# EAGLE design EagleIO (EAGLE 7.2.0)

## Sheet 1 of 4
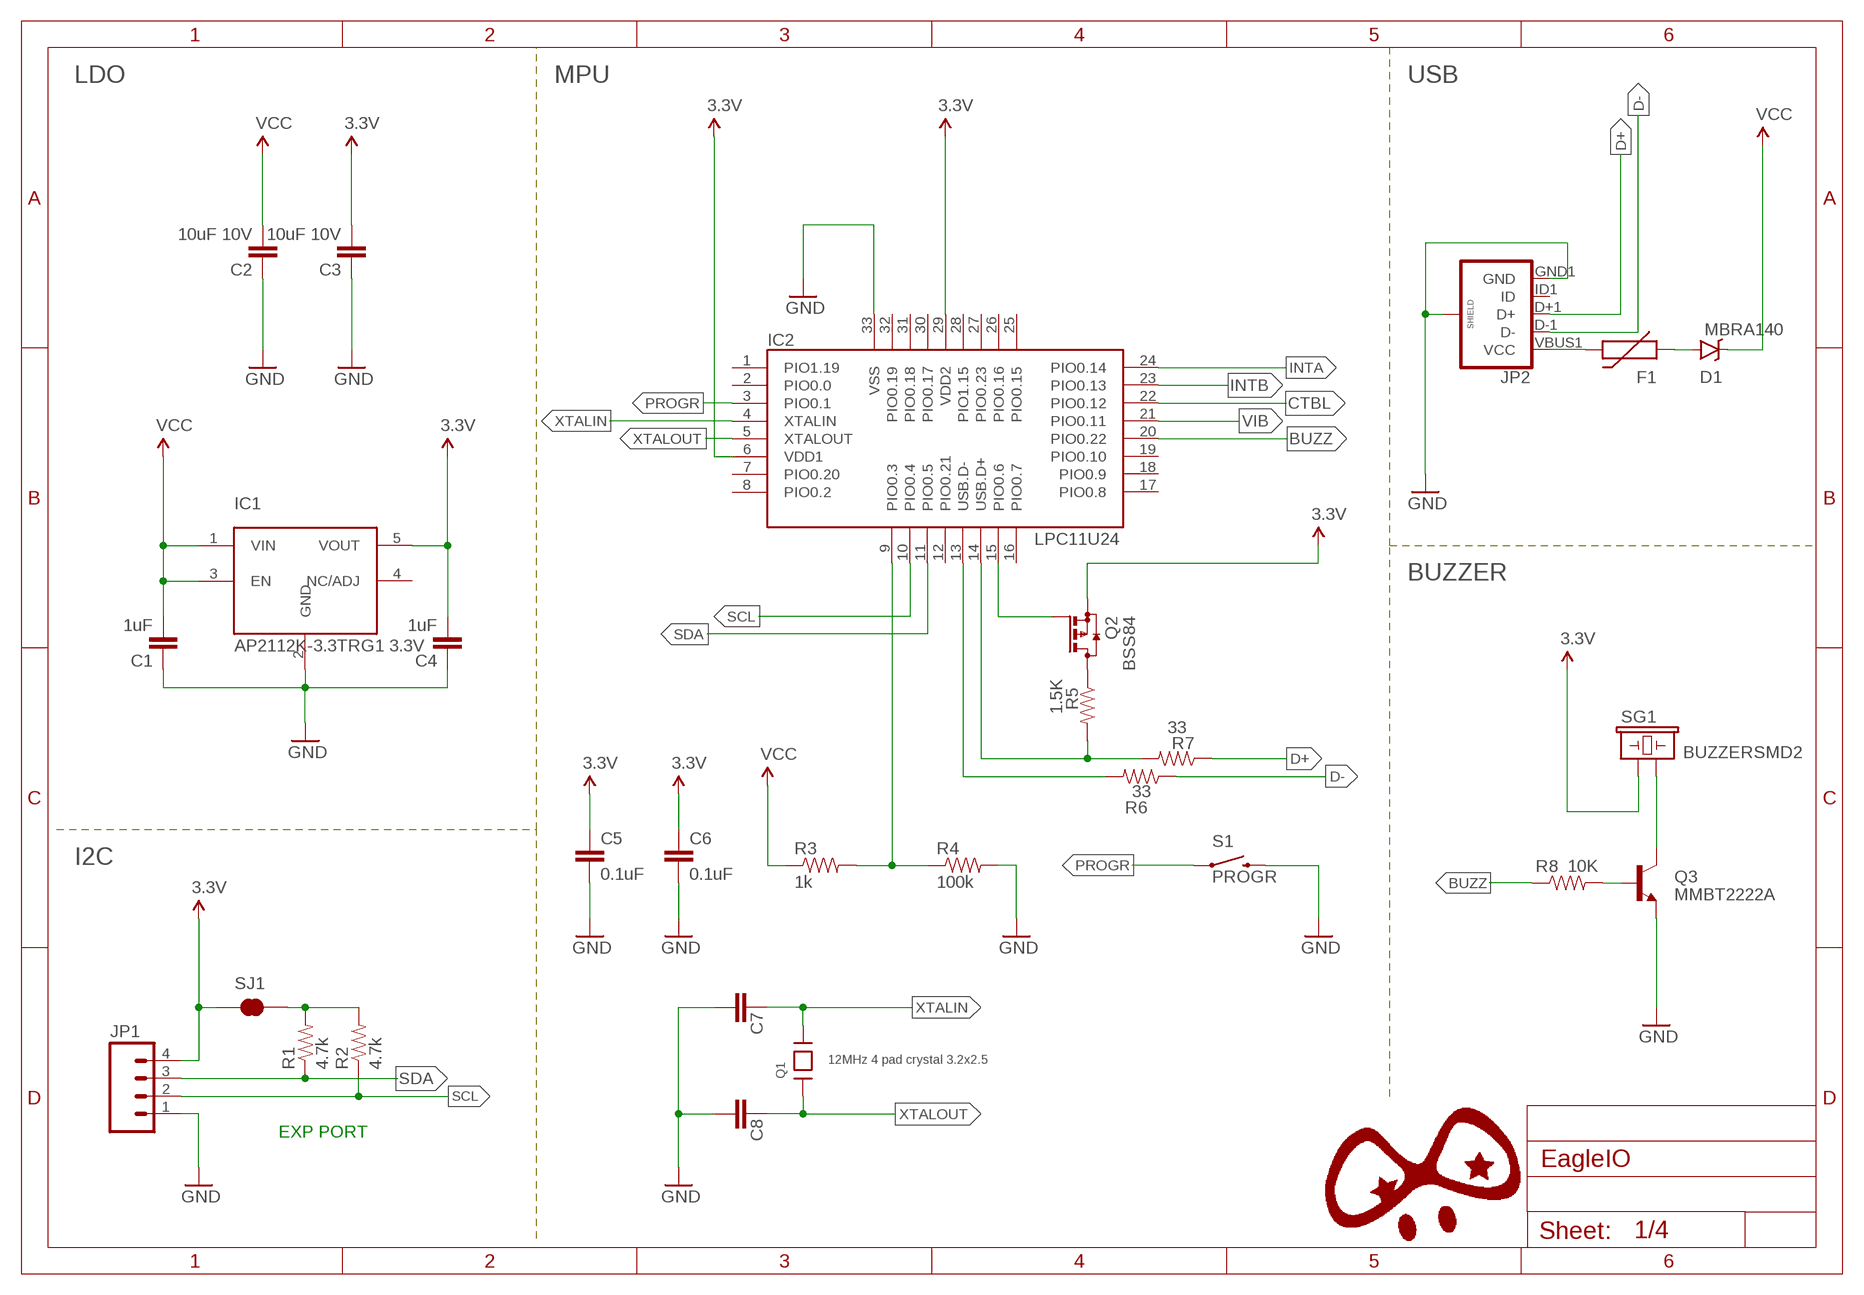
[diagram p0: schematic, sheet 1]

### Parts
C1  1uF  CAP0402-CAP  [0402-CAP]
C2  10uF 10V  CAP0402-CAP  [0402-CAP]
C3  10uF 10V  CAP0402-CAP  [0402-CAP]
C4  1uF  CAP0402-CAP  [0402-CAP]
C5  0.1uF  CAP0402-CAP  [0402-CAP]
C6  0.1uF  CAP0402-CAP  [0402-CAP]
C7  27pF  CAP0402-CAP  [0402-CAP]
C8  27pF  CAP0402-CAP  [0402-CAP]
D1  MBRA140  [SMA-DIODE]
F1  PTC0603  [0603]
IC1  AP2112K-3.3TRG1 3.3V  5PIN_REG  [SOT23-5]
IC2  LPC11U24  LPC11U2X_HVQFN33(5X5)  [HVQFN33_5X5MM]
JP1  M04LONGPADS  [1X04_LONGPADS]
JP2  USB_MICROB_PLUGCONN-11752  [USB-B-MICRO-SMD_V03]
Q1  12MHz 4 pad crystal 3.2x2.5  CRYSTAL3.2X2.5  [CRYSTAL_3.2X2.5]
Q2  BSS84  [SOT23]
Q3  MMBT2222A  TRANSISTOR_NPNMMBT2222A  [SOT23-3]
R1  4.7k  RESISTOR0402-RES  [0402-RES]
R2  4.7k  RESISTOR0402-RES  [0402-RES]
R3  1k  RESISTOR0402-RES  [0402-RES]
R4  100k  RESISTOR0402-RES  [0402-RES]
R5  1.5K  RESISTOR0402-RES  [0402-RES]
R6  33  RESISTOR0402-RES  [0402-RES]
R7  33  RESISTOR0402-RES  [0402-RES]
R8  10K  RESISTOR0402-RES  [0402-RES]
S1  PROGR  SWITCH-MOMENTARY-2SMD-1101NE  [TACTILE-SWITCH-1101NE]
SG1  BUZZERSMD2  [BUZZER-CCV]
SJ1  JUMPER-PAD-2-NC_BY_TRACE  [PAD-JUMPER-2-NC_BY_TRACE_YES_SILK]

### Nets
3.3V: C3.2 C4.2 C5.1 C6.1 IC1.5(VOUT) IC2.6(VDD1) IC2.29(VDD2) JP1.4 Q2.2(S) SG1.+ SJ1.1 ; also sheet 2,3,4
BUZZ: IC2.20(PIO0.22) R8.1
CTBL: IC2.22(PIO0.12) ; also sheet 4
D+: JP2.D+1(D+) R7.1
D-: JP2.D-1(D-) R6.1
GND: C1.1 C2.1 C3.1 C4.1 C5.2 C6.2 C7.2 C8.2 IC1.2(GND) IC2.33(VSS) JP1.1 JP2.GND1(GND) JP2.SHIELD1(SHIELD) JP2.SHIELD2(SHIELD) JP2.SHIELD3(SHIELD) Q3.2(E) R4.2 S1.2 ; also sheet 2,3,4
INTA: IC2.24(PIO0.14) ; also sheet 2
INTB: IC2.23(PIO0.13) ; also sheet 2
N$20: D1.A F1.1
N$21: F1.2 JP2.VBUS1(VCC)
N$28: Q3.3(C) SG1.-
N$30: Q3.1(B) R8.2
N$33: IC2.14(USB.D+) R5.2 R7.2
N$34: IC2.13(USB.D-) R6.2
N$35: Q2.3(D) R5.1
N$36: IC2.15(PIO0.6) Q2.1(G)
N$37 [power]: R1.2 R2.2 SJ1.2
P0.3/ISP_COMMAND_USB_HIGH: IC2.9(PIO0.3) R3.2 R4.1
PROGR: IC2.3(PIO0.1) S1.1
SCL: IC2.10(PIO0.4) JP1.2 R2.1 ; also sheet 2,4
SDA: IC2.11(PIO0.5) JP1.3 R1.1 ; also sheet 2,4
VCC: C1.2 C2.2 D1.C IC1.1(VIN) IC1.3(EN) R3.1 ; also sheet 4
VIB: IC2.21(PIO0.11) ; also sheet 3
XTALIN: C7.1 IC2.4(XTALIN) Q1.3
XTALOUT: C8.1 IC2.5(XTALOUT) Q1.1
Unconnected: IC1.4(NC/ADJ) IC2.1(PIO1.19) IC2.2(PIO0.0) IC2.7(PIO0.20) IC2.8(PIO0.2) IC2.12(PIO0.21) IC2.16(PIO0.7) IC2.17(PIO0.8) IC2.18(PIO0.9) IC2.19(PIO0.10) IC2.25(PIO0.15) IC2.26(PIO0.16) IC2.27(PIO0.23) IC2.28(PIO1.15) IC2.30(PIO0.17) IC2.31(PIO0.18) IC2.32(PIO0.19) JP2.ID1(ID)

### Notes on the sheet
- LDO | MPU | USB
- BUZZER
- I2C
- EXP PORT

## Sheet 2 of 4
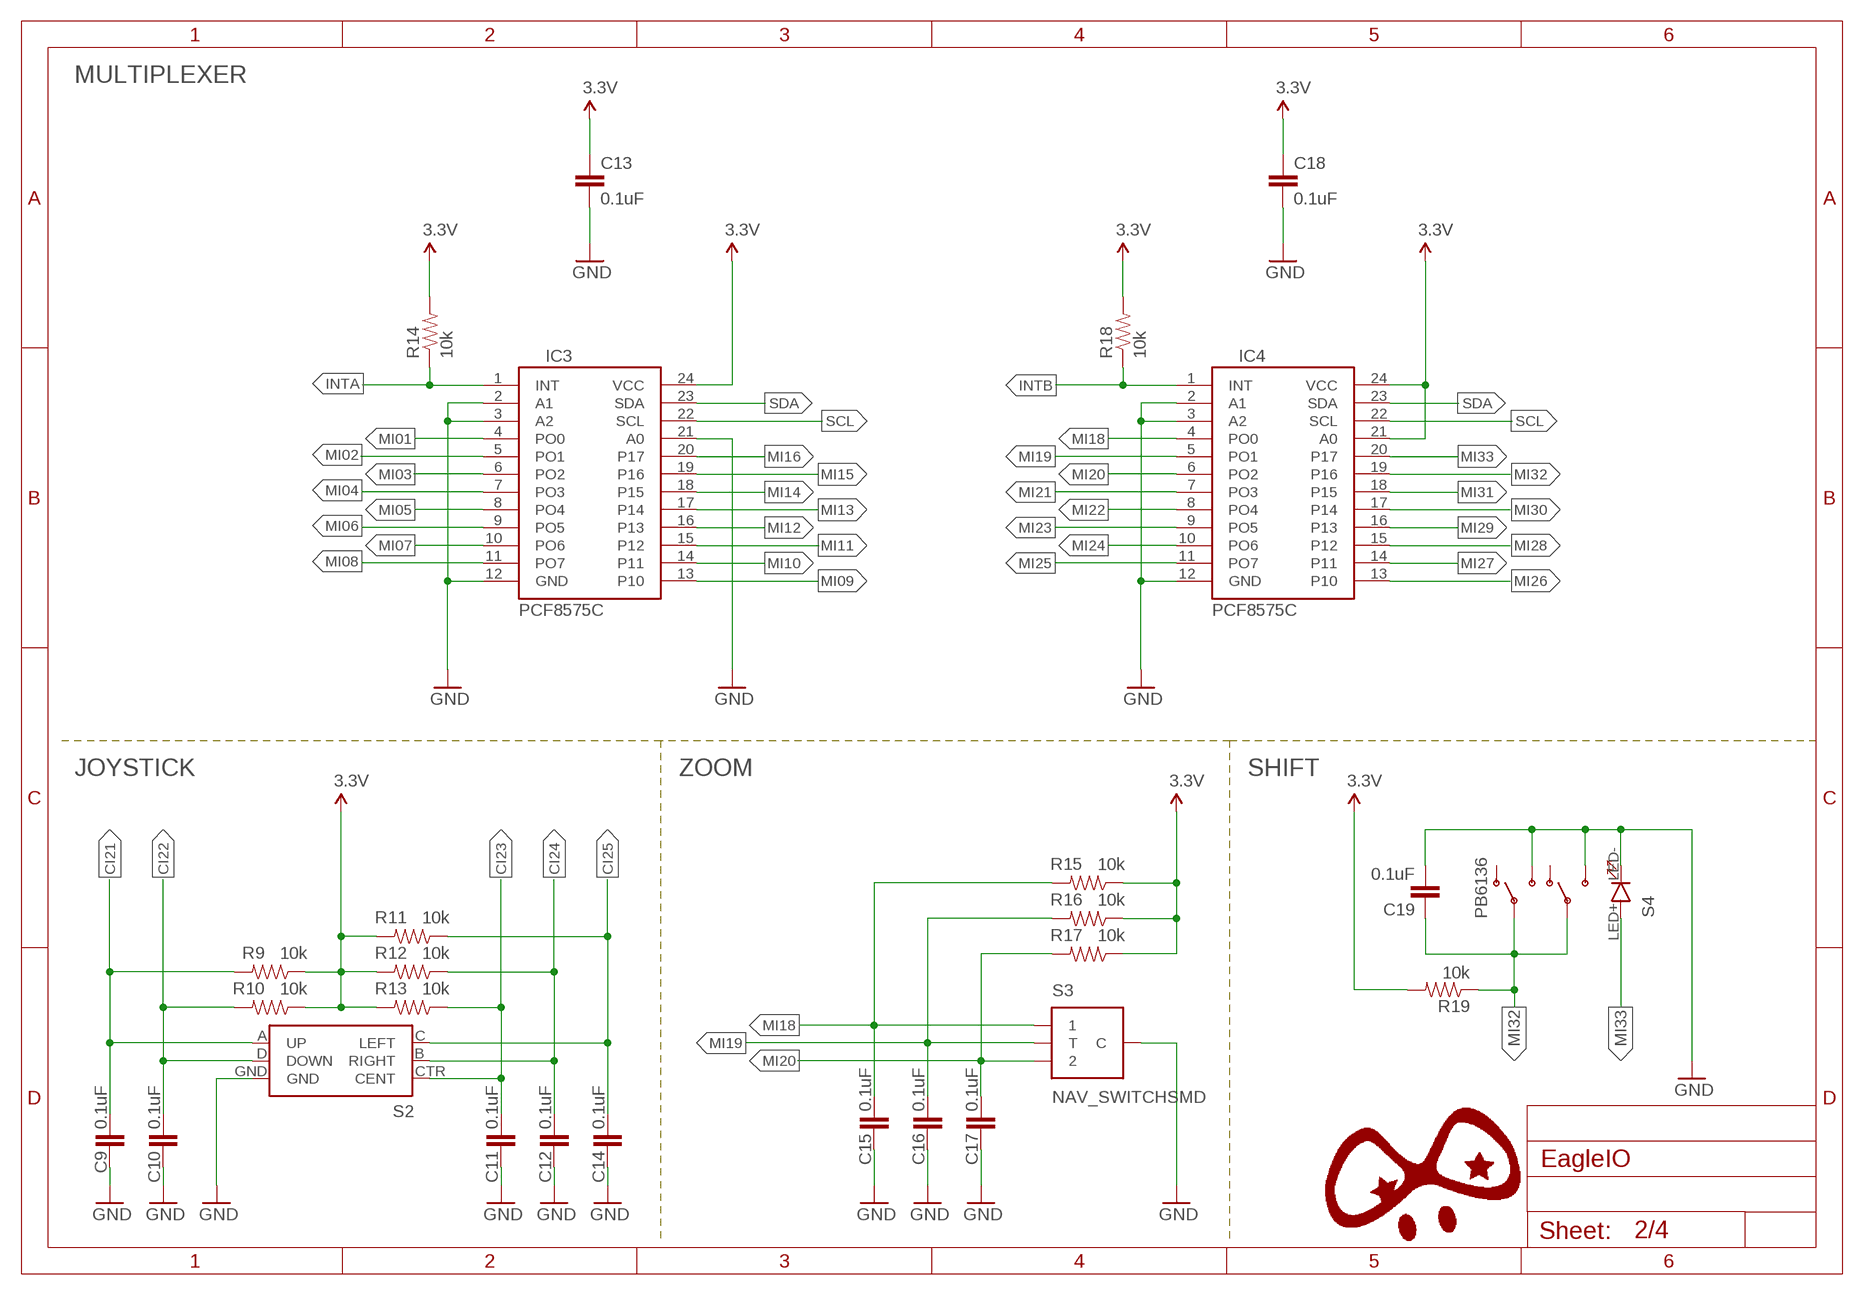
[diagram p1: schematic, sheet 2]

### Parts
C9  0.1uF  CAP0402-CAP  [0402-CAP]
C10  0.1uF  CAP0402-CAP  [0402-CAP]
C11  0.1uF  CAP0402-CAP  [0402-CAP]
C12  0.1uF  CAP0402-CAP  [0402-CAP]
C13  0.1uF  CAP0402-CAP  [0402-CAP]
C14  0.1uF  CAP0402-CAP  [0402-CAP]
C15  0.1uF  CAP0402-CAP  [0402-CAP]
C16  0.1uF  CAP0402-CAP  [0402-CAP]
C17  0.1uF  CAP0402-CAP  [0402-CAP]
C18  0.1uF  CAP0402-CAP  [0402-CAP]
C19  0.1uF  CAP0402-CAP  [0402-CAP]
IC3  PCF8575C  [SO-24DW]
IC4  PCF8575C  [SO-24DW]
R9  10k  RESISTOR0402-RES  [0402-RES]
R10  10k  RESISTOR0402-RES  [0402-RES]
R11  10k  RESISTOR0402-RES  [0402-RES]
R12  10k  RESISTOR0402-RES  [0402-RES]
R13  10k  RESISTOR0402-RES  [0402-RES]
R14  10k  RESISTOR0402-RES  [0402-RES]
R15  10k  RESISTOR0402-RES  [0402-RES]
R16  10k  RESISTOR0402-RES  [0402-RES]
R17  10k  RESISTOR0402-RES  [0402-RES]
R18  10k  RESISTOR0402-RES  [0402-RES]
R19  10k  RESISTOR0402-RES  [0402-RES]
S2  JOYSTICK_MINI  [JOYSTICK_MINI]
S3  NAV_SWITCHSMD  [NAV_SWITCH]
S4  PB6136  [PB6136]

### Nets
3.3V: C13.1 C18.1 IC3.24(VCC) IC4.21(A0) IC4.24(VCC) R9.1 R10.1 R11.2 R12.2 R13.2 R14.2 R15.1 R16.1 R17.1 R18.2 R19.2 ; also sheet 1,3,4
CI21: C9.2 R9.2 S2.A(UP) ; also sheet 4
CI22: C10.2 R10.2 S2.D(DOWN) ; also sheet 4
CI23: C11.2 R13.1 S2.CTR(CENT) ; also sheet 4
CI24: C12.2 R12.1 S2.B(RIGHT) ; also sheet 4
CI25: C14.2 R11.1 S2.C(LEFT) ; also sheet 4
GND: C9.1 C10.1 C11.1 C12.1 C13.2 C14.1 C15.1 C16.1 C17.1 C18.2 C19.2 IC3.2(A1) IC3.3(A2) IC3.12(GND) IC3.21(A0) IC4.2(A1) IC4.3(A2) IC4.12(GND) S2.GND S3.C S4.LED- S4.NO1(S) S4.NO2(S1) ; also sheet 1,3,4
INTA: IC3.1(INT) R14.1 ; also sheet 1
INTB: IC4.1(INT) R18.1 ; also sheet 1
MI01: IC3.4(PO0) ; also sheet 4
MI02: IC3.5(PO1) ; also sheet 4
MI03: IC3.6(PO2) ; also sheet 4
MI04: IC3.7(PO3) ; also sheet 4
MI05: IC3.8(PO4) ; also sheet 4
MI06: IC3.9(PO5) ; also sheet 4
MI07: IC3.10(PO6) ; also sheet 4
MI08: IC3.11(PO7) ; also sheet 4
MI09: IC3.13(P10) ; also sheet 4
MI10: IC3.14(P11) ; also sheet 4
MI11: IC3.15(P12) ; also sheet 4
MI12: IC3.16(P13) ; also sheet 4
MI13: IC3.17(P14) ; also sheet 3
MI14: IC3.18(P15) ; also sheet 3
MI15: IC3.19(P16)
MI16: IC3.20(P17)
MI18: C15.2 IC4.4(PO0) R15.2 S3.1
MI19: C16.2 IC4.5(PO1) R16.2 S3.T
MI20: C17.2 IC4.6(PO2) R17.2 S3.2
MI21: IC4.7(PO3) ; also sheet 4
MI22: IC4.8(PO4) ; also sheet 4
MI23: IC4.9(PO5) ; also sheet 4
MI24: IC4.10(PO6) ; also sheet 4
MI25: IC4.11(PO7) ; also sheet 4
MI26: IC4.13(P10) ; also sheet 4
MI27: IC4.14(P11) ; also sheet 4
MI28: IC4.15(P12) ; also sheet 4
MI29: IC4.16(P13)
MI30: IC4.17(P14)
MI31: IC4.18(P15)
MI32: C19.1 IC4.19(P16) R19.1 S4.C1(P) S4.C2(P1)
MI33: IC4.20(P17) S4.LED+
SCL: IC3.22(SCL) IC4.22(SCL) ; also sheet 1,4
SDA: IC3.23(SDA) IC4.23(SDA) ; also sheet 1,4
Unconnected: S4.NC1(O) S4.NC2(O1)

### Notes on the sheet
- MULTIPLEXER
- JOYSTICK | ZOOM | SHIFT

## Sheet 3 of 4
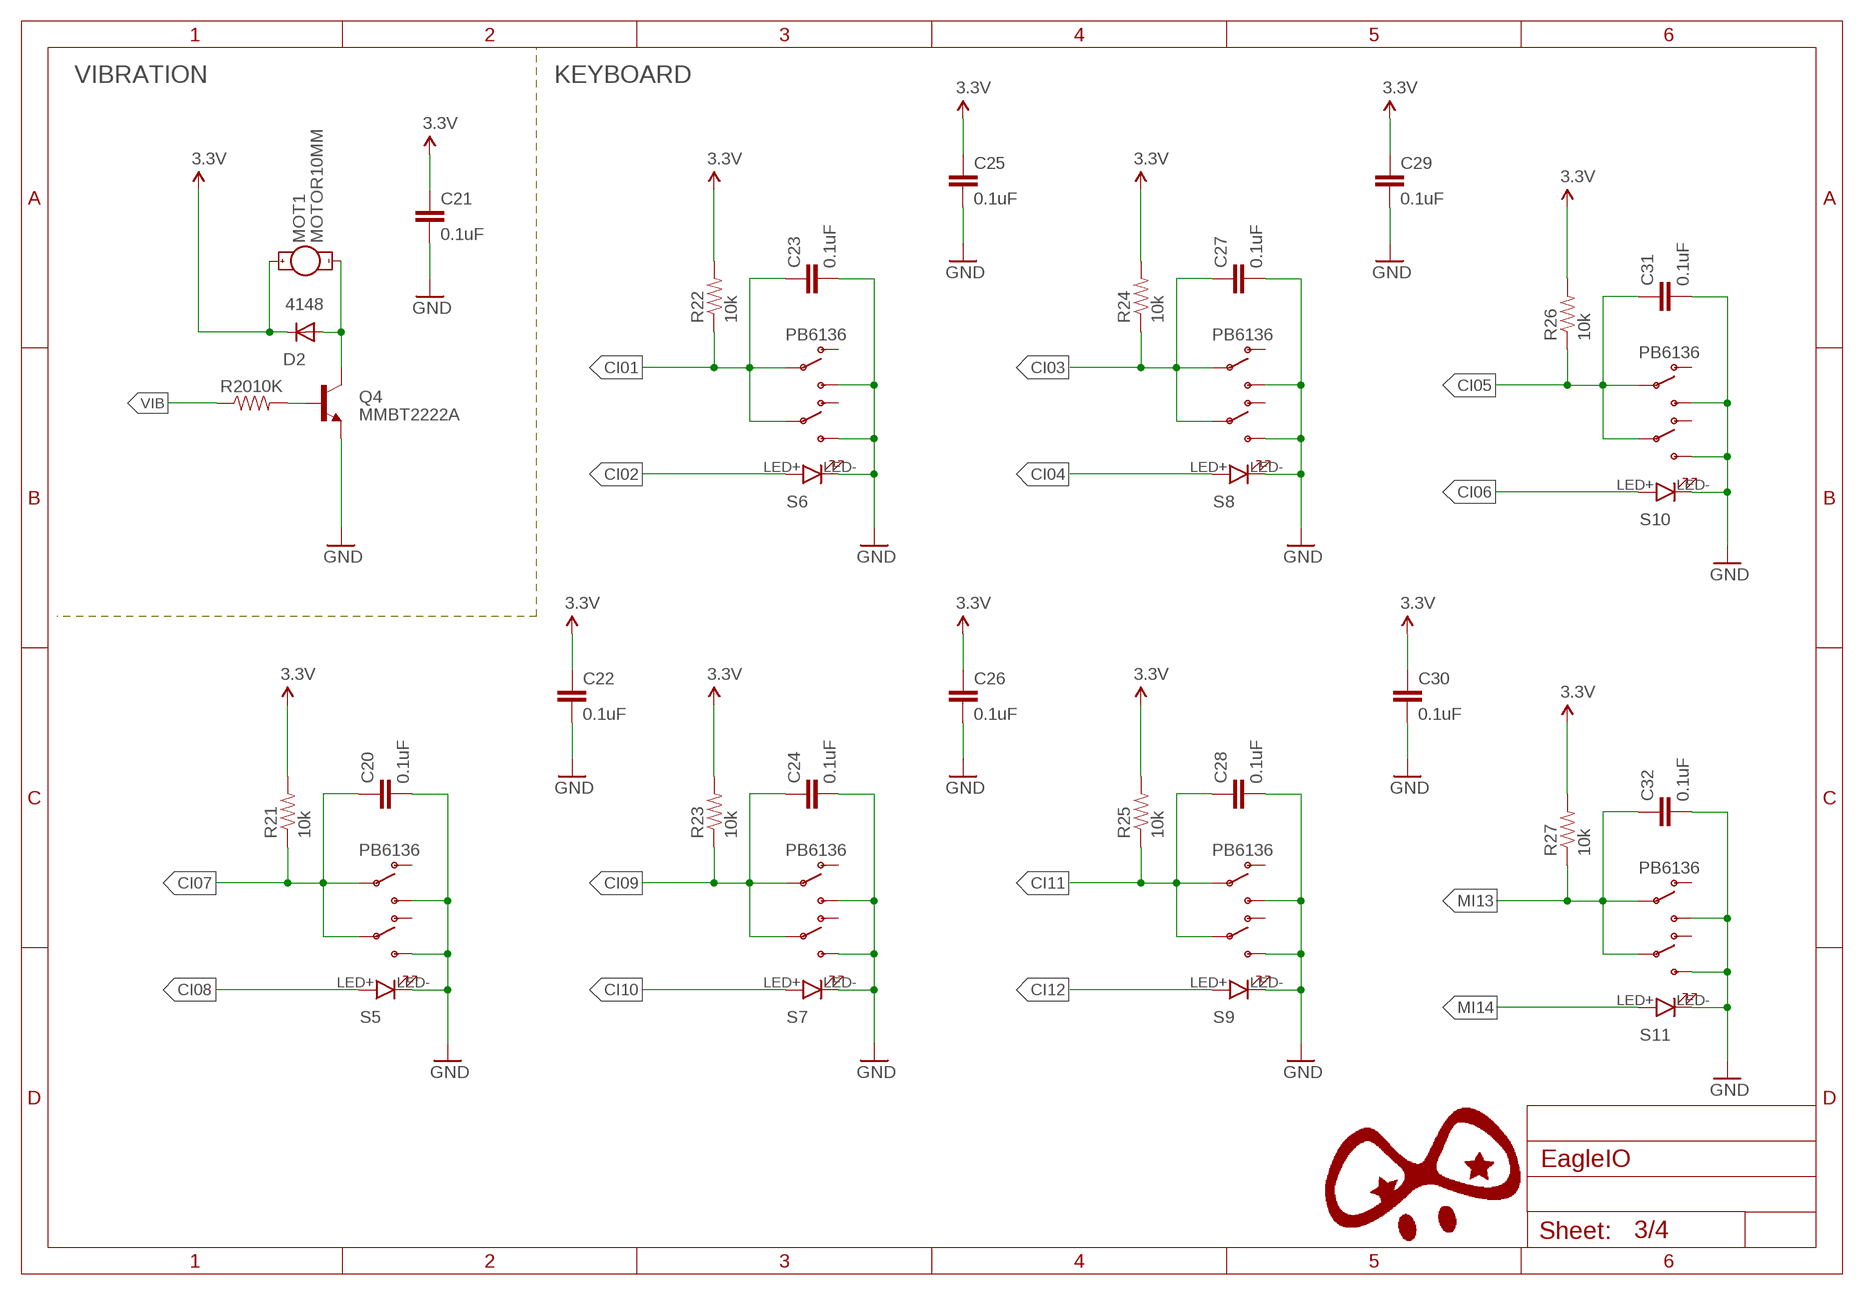
[diagram p2: schematic, sheet 3]

### Parts
C20  0.1uF  CAP0402-CAP  [0402-CAP]
C21  0.1uF  CAP0402-CAP  [0402-CAP]
C22  0.1uF  CAP0402-CAP  [0402-CAP]
C23  0.1uF  CAP0402-CAP  [0402-CAP]
C24  0.1uF  CAP0402-CAP  [0402-CAP]
C25  0.1uF  CAP0402-CAP  [0402-CAP]
C26  0.1uF  CAP0402-CAP  [0402-CAP]
C27  0.1uF  CAP0402-CAP  [0402-CAP]
C28  0.1uF  CAP0402-CAP  [0402-CAP]
C29  0.1uF  CAP0402-CAP  [0402-CAP]
C30  0.1uF  CAP0402-CAP  [0402-CAP]
C31  0.1uF  CAP0402-CAP  [0402-CAP]
C32  0.1uF  CAP0402-CAP  [0402-CAP]
D2  4148  DIODE-MINIMELF  [MINIMELF]
MOT1  MOTOR10MM  [VIBE-MOTOR-10MM]
Q4  MMBT2222A  TRANSISTOR_NPNMMBT2222A  [SOT23-3]
R20  10K  RESISTOR0402-RES  [0402-RES]
R21  10k  RESISTOR0402-RES  [0402-RES]
R22  10k  RESISTOR0402-RES  [0402-RES]
R23  10k  RESISTOR0402-RES  [0402-RES]
R24  10k  RESISTOR0402-RES  [0402-RES]
R25  10k  RESISTOR0402-RES  [0402-RES]
R26  10k  RESISTOR0402-RES  [0402-RES]
R27  10k  RESISTOR0402-RES  [0402-RES]
S5  PB6136  [PB6136]
S6  PB6136  [PB6136]
S7  PB6136  [PB6136]
S8  PB6136  [PB6136]
S9  PB6136  [PB6136]
S10  PB6136  [PB6136]
S11  PB6136  [PB6136]

### Nets
3.3V: C21.1 C22.1 C25.1 C26.1 C29.1 C30.1 D2.C MOT1.+ R21.2 R22.2 R23.2 R24.2 R25.2 R26.2 R27.2 ; also sheet 1,2,4
CI01: C23.1 R22.1 S6.C1(P) S6.C2(P1) ; also sheet 4
CI02: S6.LED+ ; also sheet 4
CI03: C27.1 R24.1 S8.C1(P) S8.C2(P1) ; also sheet 4
CI04: S8.LED+ ; also sheet 4
CI05: C31.1 R26.1 S10.C1(P) S10.C2(P1) ; also sheet 4
CI06: S10.LED+ ; also sheet 4
CI07: C20.1 R21.1 S5.C1(P) S5.C2(P1) ; also sheet 4
CI08: S5.LED+ ; also sheet 4
CI09: C24.1 R23.1 S7.C1(P) S7.C2(P1) ; also sheet 4
CI10: S7.LED+ ; also sheet 4
CI11: C28.1 R25.1 S9.C1(P) S9.C2(P1) ; also sheet 4
CI12: S9.LED+ ; also sheet 4
GND: C20.2 C21.2 C22.2 C23.2 C24.2 C25.2 C26.2 C27.2 C28.2 C29.2 C30.2 C31.2 C32.2 Q4.2(E) S5.LED- S5.NO1(S) S5.NO2(S1) S6.LED- S6.NO1(S) S6.NO2(S1) S7.LED- S7.NO1(S) S7.NO2(S1) S8.LED- S8.NO1(S) S8.NO2(S1) S9.LED- S9.NO1(S) S9.NO2(S1) S10.LED- S10.NO1(S) S10.NO2(S1) S11.LED- S11.NO1(S) S11.NO2(S1) ; also sheet 1,2,4
MI13: C32.1 R27.1 S11.C1(P) S11.C2(P1) ; also sheet 2
MI14: S11.LED+ ; also sheet 2
N$1: D2.A MOT1.- Q4.3(C)
N$2: Q4.1(B) R20.2
VIB: R20.1 ; also sheet 1
Unconnected: S5.NC1(O) S5.NC2(O1) S6.NC1(O) S6.NC2(O1) S7.NC1(O) S7.NC2(O1) S8.NC1(O) S8.NC2(O1) S9.NC1(O) S9.NC2(O1) S10.NC1(O) S10.NC2(O1) S11.NC1(O) S11.NC2(O1)

### Notes on the sheet
- VIBRATION | KEYBOARD

## Sheet 4 of 4
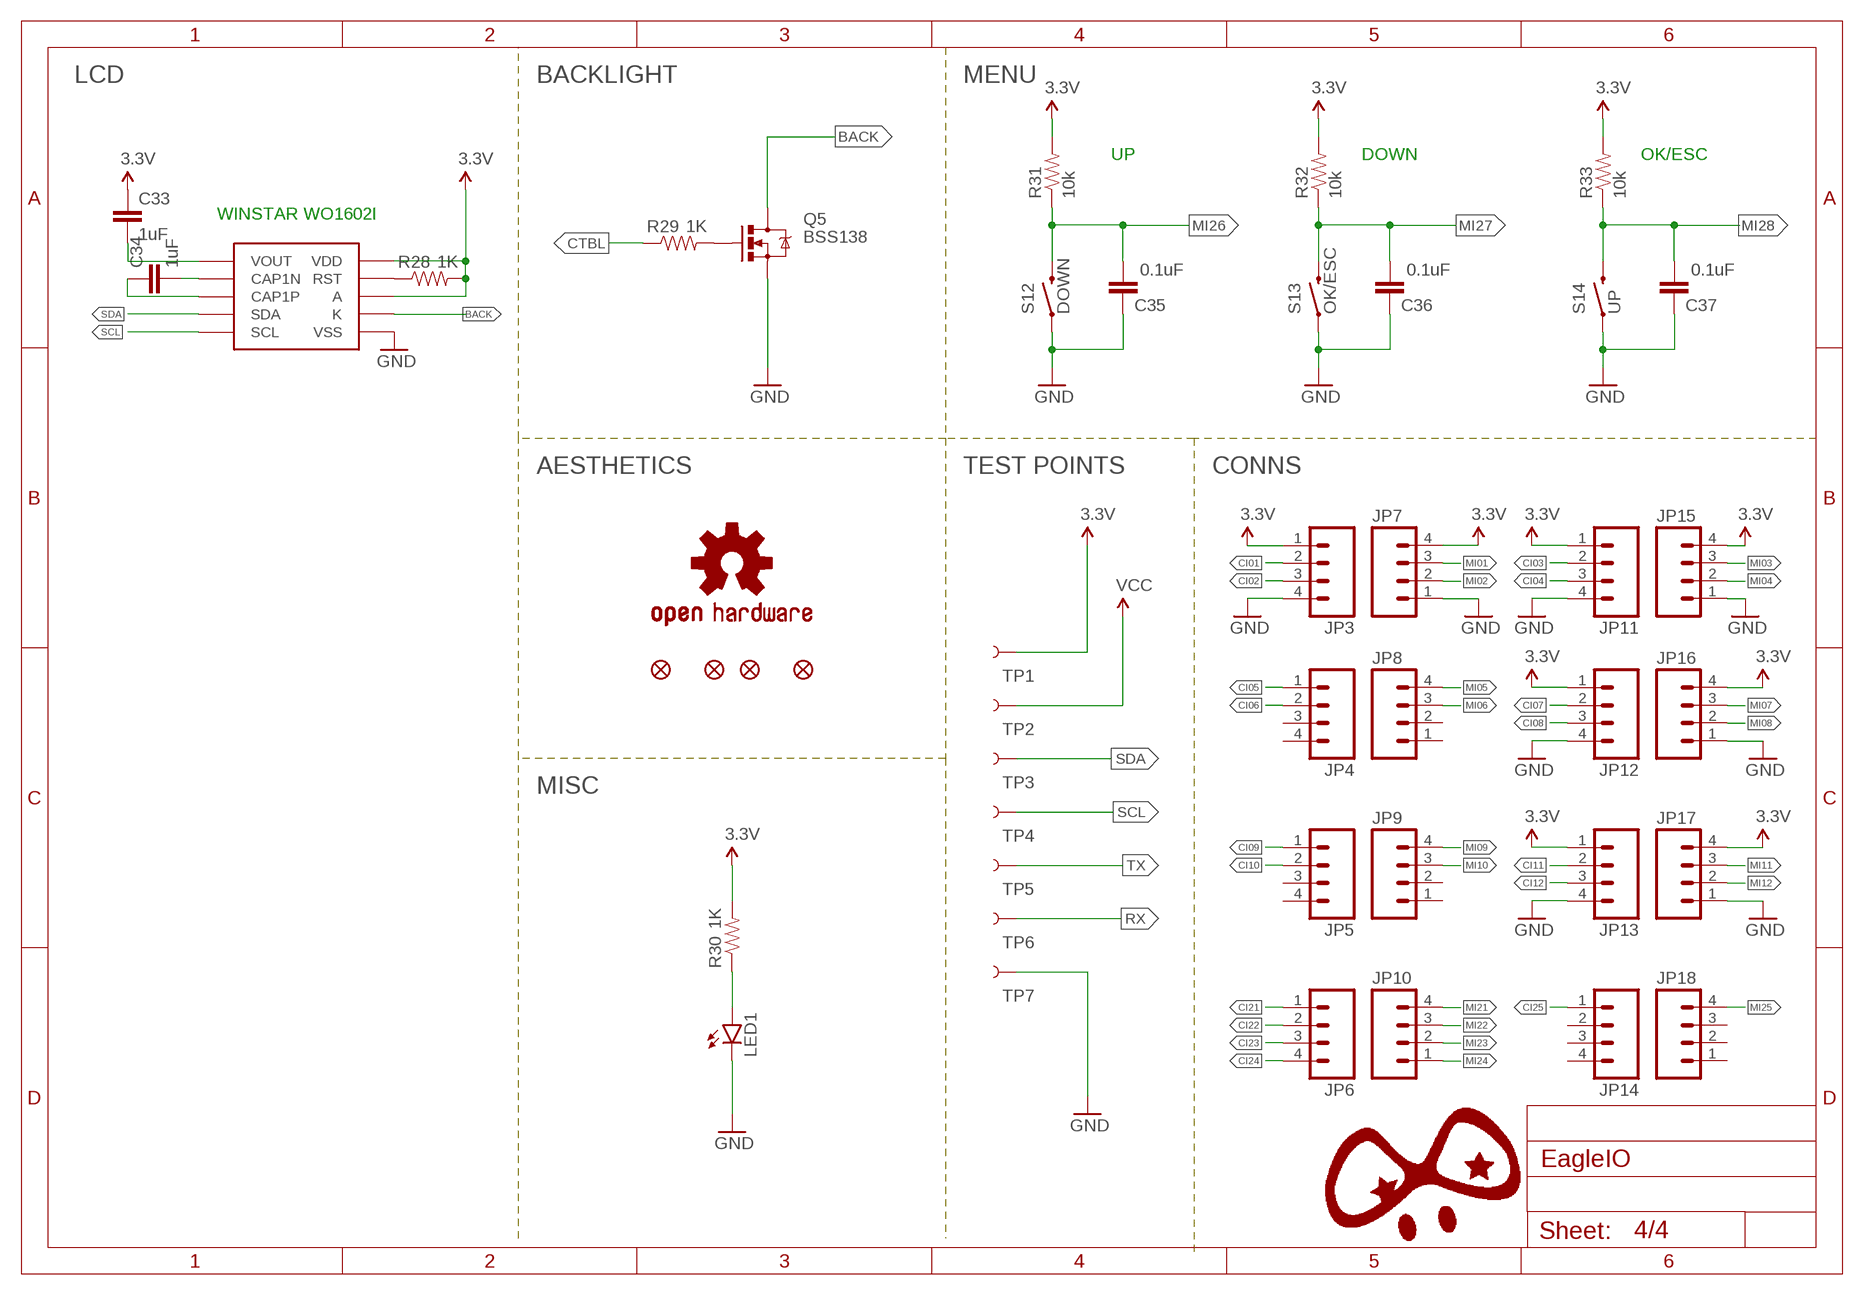
[diagram p3: schematic, sheet 4]

### Parts
C33  1uF  CAP0402-CAP  [0402-CAP]
C34  1uF  CAP0402-CAP  [0402-CAP]
C35  0.1uF  CAP0402-CAP  [0402-CAP]
C36  0.1uF  CAP0402-CAP  [0402-CAP]
C37  0.1uF  CAP0402-CAP  [0402-CAP]
FID1  FIDUCIAL1X2  [FIDUCIAL-1X2]
FID2  FIDUCIAL1X2  [FIDUCIAL-1X2]
FID3  FIDUCIAL1X2  [FIDUCIAL-1X2]
FID4  FIDUCIAL1X2  [FIDUCIAL-1X2]
JP3  M041.27MM  [1X04-1.27MM]
JP4  M041.27MM  [1X04-1.27MM]
JP5  M041.27MM  [1X04-1.27MM]
JP6  M041.27MM  [1X04-1.27MM]
JP7  M041.27MM  [1X04-1.27MM]
JP8  M041.27MM  [1X04-1.27MM]
JP9  M041.27MM  [1X04-1.27MM]
JP10  M041.27MM  [1X04-1.27MM]
JP11  M041.27MM  [1X04-1.27MM]
JP12  M041.27MM  [1X04-1.27MM]
JP13  M041.27MM  [1X04-1.27MM]
JP14  M041.27MM  [1X04-1.27MM]
JP15  M041.27MM  [1X04-1.27MM]
JP16  M041.27MM  [1X04-1.27MM]
JP17  M041.27MM  [1X04-1.27MM]
JP18  M041.27MM  [1X04-1.27MM]
LCD1  WINSTAR_WO1602I  [WINSTAR_WO1602I]
LED1  LED0603  [LED-0603]
LOGO1  OSHW-LOGOS  [OSHW-LOGO-S]
Q5  BSS138  MOSFET-NCHANNEL2N7002PW  [SOT323]
R28  1K  RESISTOR0402-RES  [0402-RES]
R29  1K  RESISTOR0402-RES  [0402-RES]
R30  1K  RESISTOR0402-RES  [0402-RES]
R31  10k  RESISTOR0402-RES  [0402-RES]
R32  10k  RESISTOR0402-RES  [0402-RES]
R33  10k  RESISTOR0402-RES  [0402-RES]
S12  DOWN  SWITCH-MOMENTARY-2SMD-1101NE  [TACTILE-SWITCH-1101NE]
S13  OK/ESC  SWITCH-MOMENTARY-2SMD-1101NE  [TACTILE-SWITCH-1101NE]
S14  UP  SWITCH-MOMENTARY-2SMD-1101NE  [TACTILE-SWITCH-1101NE]
TP1  TEST-POINT3X5  [PAD.03X.05]
TP2  TEST-POINT3X5  [PAD.03X.05]
TP3  TEST-POINT3X5  [PAD.03X.05]
TP4  TEST-POINT3X5  [PAD.03X.05]
TP5  TEST-POINT3X5  [PAD.03X.05]
TP6  TEST-POINT3X5  [PAD.03X.05]
TP7  TEST-POINT3X5  [PAD.03X.05]

### Nets
3.3V: C33.1 JP3.1 JP7.4 JP11.1 JP12.1 JP13.1 JP15.4 JP16.4 JP17.4 LCD1.AB(A) LCD1.AT(A) LCD1.VDD R28.2 R30.2 R31.2 R32.2 R33.2 TP1.P$1 ; also sheet 1,2,3
BACK: LCD1.KB(K) LCD1.KT(K) Q5.3(D)
CI01: JP3.2 ; also sheet 3
CI02: JP3.3 ; also sheet 3
CI03: JP11.2 ; also sheet 3
CI04: JP11.3 ; also sheet 3
CI05: JP4.1 ; also sheet 3
CI06: JP4.2 ; also sheet 3
CI07: JP12.2 ; also sheet 3
CI08: JP12.3 ; also sheet 3
CI09: JP5.1 ; also sheet 3
CI10: JP5.2 ; also sheet 3
CI11: JP13.2 ; also sheet 3
CI12: JP13.3 ; also sheet 3
CI21: JP6.1 ; also sheet 2
CI22: JP6.2 ; also sheet 2
CI23: JP6.3 ; also sheet 2
CI24: JP6.4 ; also sheet 2
CI25: JP14.1 ; also sheet 2
CTBL: R29.1 ; also sheet 1
GND: C35.1 C36.1 C37.1 JP3.4 JP7.1 JP11.4 JP12.4 JP13.4 JP15.1 JP16.1 JP17.1 LCD1.VSS LED1.C Q5.2(S) S12.1 S13.1 S14.1 TP7.P$1 ; also sheet 1,2,3
MI01: JP7.3 ; also sheet 2
MI02: JP7.2 ; also sheet 2
MI03: JP15.3 ; also sheet 2
MI04: JP15.2 ; also sheet 2
MI05: JP8.4 ; also sheet 2
MI06: JP8.3 ; also sheet 2
MI07: JP16.3 ; also sheet 2
MI08: JP16.2 ; also sheet 2
MI09: JP9.4 ; also sheet 2
MI10: JP9.3 ; also sheet 2
MI11: JP17.3 ; also sheet 2
MI12: JP17.2 ; also sheet 2
MI21: JP10.4 ; also sheet 2
MI22: JP10.3 ; also sheet 2
MI23: JP10.2 ; also sheet 2
MI24: JP10.1 ; also sheet 2
MI25: JP18.4 ; also sheet 2
MI26: C35.2 R31.1 S12.2 ; also sheet 2
MI27: C36.2 R32.1 S13.2 ; also sheet 2
MI28: C37.2 R33.1 S14.2 ; also sheet 2
N$6: Q5.1(G) R29.2
N$8: LED1.A R30.1
N$10: C33.2 LCD1.VOUT
N$11: LCD1.RST R28.1
N$12: C34.2 LCD1.CAPN(CAP1N)
N$13: C34.1 LCD1.CAP1P
RX: TP6.P$1
SCL: LCD1.SCL TP4.P$1 ; also sheet 1,2
SDA: LCD1.SDA TP3.P$1 ; also sheet 1,2
TX: TP5.P$1
VCC: TP2.P$1 ; also sheet 1
Unconnected: JP4.3 JP4.4 JP5.3 JP5.4 JP8.1 JP8.2 JP9.1 JP9.2 JP14.2 JP14.3 JP14.4 JP18.1 JP18.2 JP18.3

### Notes on the sheet
- LCD | BACKLIGHT | MENU
- UP | DOWN | OK/ESC
- WINSTAR WO1602I
- AESTHETICS | TEST POINTS | CONNS
- MISC

## Library data of the parts
C1-C37 = SparkFun-Passives:CAP: Capacitor Standard 0603 ceramic capacitor, and 0.1" leaded capacitor.
D1 = SparkFun-DiscreteSemi:MBRA140: 40V, 1A Schottky rectifier SMA/DO-214AC package DIO-08053; PROD_ID: DIO-08053
D2 = diode:DIODE-: DIODE
F1 = SparkFun-PowerIC:PTC: Resettable Fuse PTC Resettable Fuse. Spark Fun Electronics SKU : COM-08357
FID1-FID4 = SparkFun-Aesthetics:FIDUCIAL: Fiducial Alignment Points Various fiducial points for machine vision alignment.
IC1 = GHI:5PIN_REG
IC2 = GHI-SoMs-Processors:LPC11U2X_HVQFN33(5X5)
IC3 IC4 = SparkFun-DigitalIC:PCF8575C: PCF8575C I/O Expander.
JP1 JP3-JP18 = SparkFun-Connectors:M04: Header 4 Standard 4-pin 0.1" header. Use with straight break away headers (SKU : PRT-00116), right angle break away headers (PRT-00553), swiss pins (PRT-00743), machine pins (PRT-00117), and female headers (PRT-00115). Molex polarized connector foot print use with SKU : PRT-08231 with associated crimp pins and housings. 1MM SMD Version SKU: PRT-10208
JP2 = SparkFun-Connectors:USB_MICROB_PLUG: USB Micro-B connectors Some male, some female. Watch your step!; PROD_ID: CONN-11752
LCD1 = pighiXXX:WINSTAR_WO1602I
LED1 = SparkFun-LED:LED: LEDs Standard schematic elements and footprints for 5mm, 3mm, 1206, and 0603 sized LEDs. 5mm - Spark Fun Electronics SKU : COM-00529 (and others)
LOGO1 = SparkFun-Aesthetics:OSHW-LOGO: Open Source Hardware Logo This logo indicates the piece of hardware it is found on incorporates a OSHW license and/or adheres to the definition of open source hardware found here: http://freedomdefined.org/OSHW
MOT1 = SparkFun-Electromechanical:MOTOR: Vibration Motor- ROB-08449 Physical dimension and wire connections for this powerful vibration motor. Motor has a self adhesive backing.
Q1 = GHI:CRYSTAL3.2X2.5
Q2 = transistor-small-signal:BSS84: P-CHANNEL MOS FET
Q3 Q4 = SparkFun-DiscreteSemi:TRANSISTOR_NPN: Generic NPN BJT MMBT2222A - TRANS-08049 (SOT-23, 1A 40V) MPSA42 - TRANS-09116 (SOT-23, 500mA 300V) MMBT5088LT1G - TRANS-11160 (SOT-23, 50 mA 30V) BC547 - COM-08928 (TO-92 45V 100mA) (1.Collector 2.Base 3.Emitter) 2N3904 - COM-00521 (TO-92 40V 200mA) (1.Emitter 2.Base 3.Collector) P2N2222A - COM-12852 (TO-92 40V 600mA) (1.Collector 2.Base 3.Emitter); PROD_ID: TRANS-08049
Q5 = SparkFun-DiscreteSemi:MOSFET-NCHANNEL: Common NMOSFET Parts MFG P/N Store ID Prod ID FDD8780 TRANS-09984 SI7820DN TRANS-11055 FDS6630A IC-08089 2N7002PW TRANS-11151 FQP30N06L COM-10213 TRANS-10060 BSS123LT1G TRANS-08345 BSS138 TRANS-00830 BS170 2N7000; PROD_ID: TRANS-11151
R1-R7 R9-R19 R21-R27 R31-R33 = SparkFun-Passives:RESISTOR: Resistor Basic schematic elements and footprints for 0603, 1206, and PTH resistors.
R8 R20 R28-R30 = SparkFun:RESISTOR: Resistor Basic schematic elements and footprints for 0603, 1206, and PTH resistors.
S1 S12-S14 = SparkFun-Electromechanical:SWITCH-MOMENTARY-2: Various NO switches- pushbuttons, reed, etc; PROD_ID: SWCH-00815
S2 = SparkFun-Electromechanical:JOYSTICK_MINI: Small 5-way tactile joystick, COM-10063 4UCON SF303GJ26; PROD_ID: SWCH-09905
S3 = SparkFun-Electromechanical:NAV_SWITCH: Navigation Switch Three way navigation switch. Commonly used as up/down/select on MP3 players. Schematic element and footprint production proven. Spark Fun Electronics SKU : COM-08184
S4-S11 = SparkFun-Electromechanical:PB6136
SG1 = SparkFun-Electromechanical:BUZZER: Buzzer 12mm Spark Fun Electronics SKU : Comp-Buzzer
SJ1 = SparkFun-Passives:JUMPER-PAD-2-NC_BY_TRACE
TP1-TP7 = SparkFun-Passives:TEST-POINT: Bare copper test points for troubleshooting or ICT

## Net classes
0 default: width 0.254 mm, drill 0.254 mm, clearance 0.203 mm
1 power: width 0.61 mm, drill 0.61 mm, clearance 0.254 mm

## Board
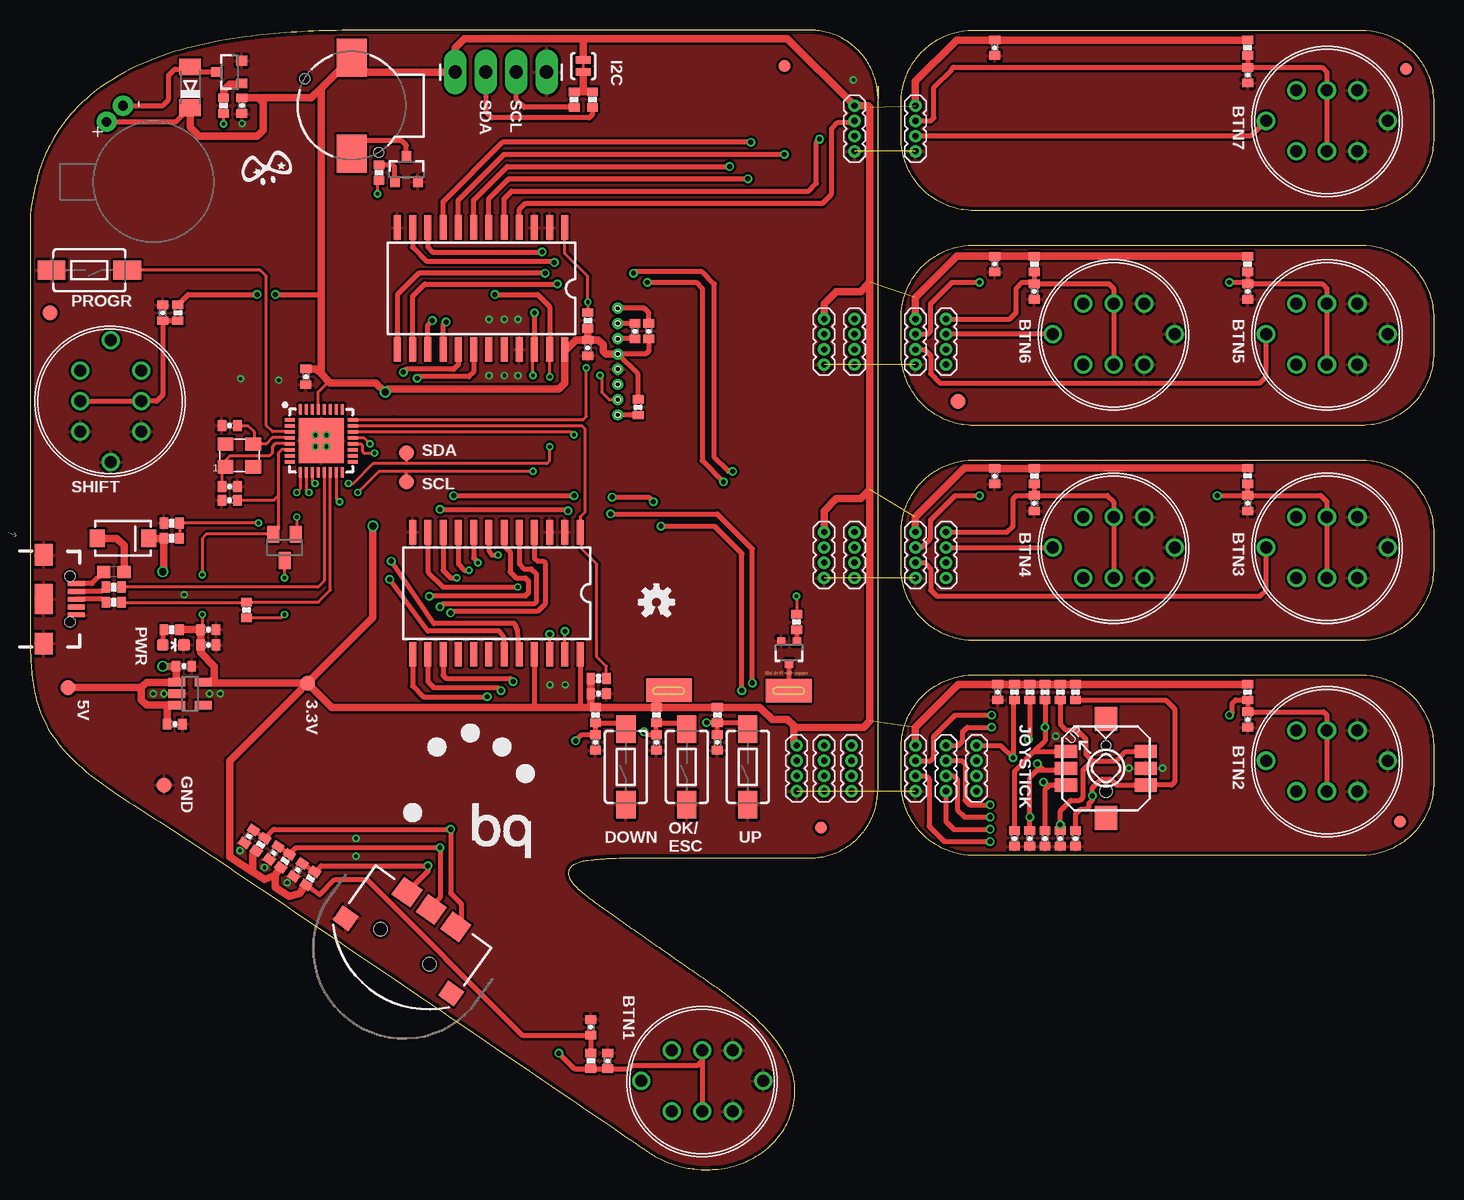
[diagram p4: board, top side]
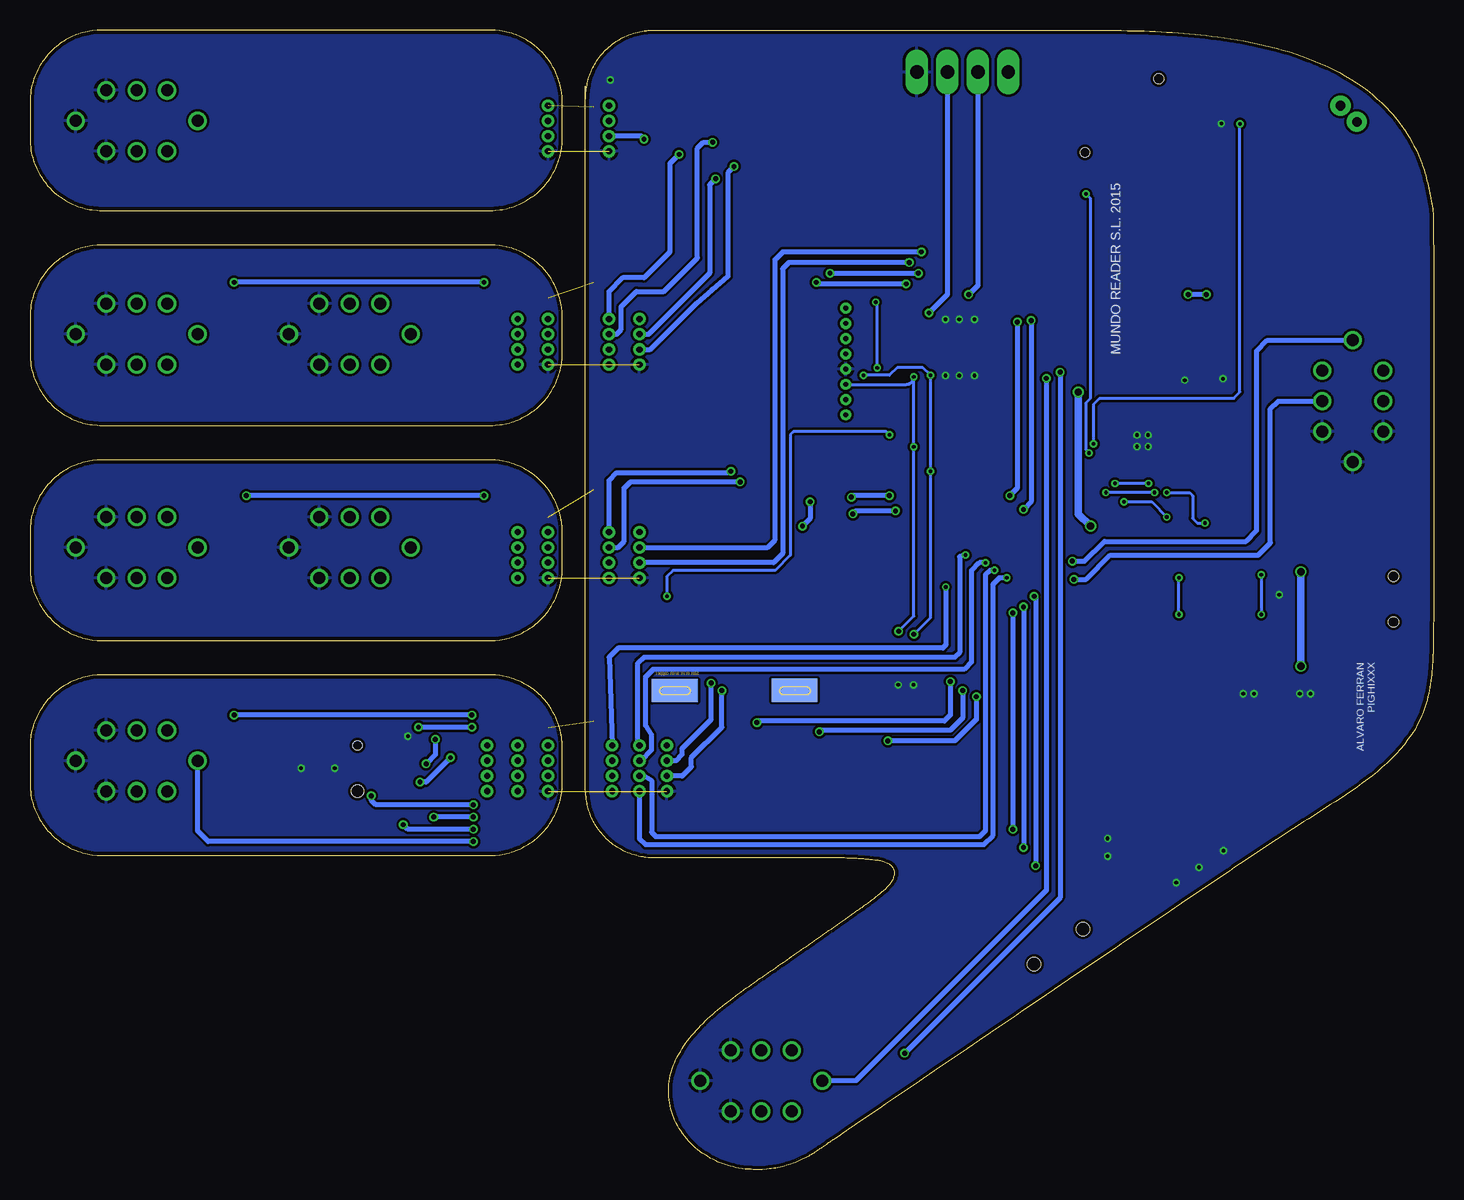
[diagram p5: board, bottom side, seen from below]

Size 116.96 x 95.01 mm. Coordinates in mm from the lower left corner, seen from the top.
Outline: 1309 segments
Copper layers (1*16): Top 0.035mm / dielectric 1.5mm / Bottom 0.035mm
Design rules "pighixxx_CAM_DRC_V1.0": minimum track width 6mil, minimum drill 12mil, track to track 6mil, track to pad 6mil, pad to pad 6mil, via to via 6mil, smd to smd 0mil, copper to edge 10mil, drill to drill 10mil, minimum pad ring 10mil, minimum via ring 6mil, stop-mask expansion 2mil, vias tented up to drill 100mil, thermal gap 10mil

### Footprints (pad centres in the part's own frame; a part is rotated, then mirrored left to right if it is on the bottom)
0402-CAP = smd 0.7 x 0.9: 1 -0.65,0; 2 0.65,0
SMA-DIODE = smd 1.27 x 1.47: A -2.15,0; C 2.15,0
MINIMELF = smd 1.4 x 1.8: A 1.7,0; C -1.7,0
0603 = smd 1.1 x 1: 1 -0.85,0; 2 0.85,0
FIDUCIAL-1X2 = smd 1 x 1: 1 0,0
SOT23-5 = smd 0.7 x 1.4: 1 0.95,1.1; 2 0,1.1; 3 -0.95,1.1; 4 -0.95,-1.1; 5 0.95,-1.1
HVQFN33_5X5MM = smd 0.85 x 0.27: 1 -2.625,1.75; 2 -2.625,1.25; 3 -2.625,0.75; 4 -2.625,0.25; 5 -2.625,-0.25; 6 -2.625,-0.75; 7 -2.625,-1.25; 8 -2.625,-1.75; 17 2.625,-1.75; 18 2.625,-1.25; 19 2.625,-0.75; 20 2.625,-0.25; 21 2.625,0.25; 22 2.625,0.75; 23 2.625,1.25; 24 2.625,1.75 | smd 0.27 x 0.85: 9 -1.75,-2.625; 10 -1.25,-2.625; 11 -0.75,-2.625; 12 -0.25,-2.625; 13 0.25,-2.625; 14 0.75,-2.625; 15 1.25,-2.625; 16 1.75,-2.625; 25 1.75,2.625; 26 1.25,2.625; 27 0.75,2.625; 28 0.25,2.625; 29 -0.25,2.625; 30 -0.75,2.625; 31 -1.25,2.625; 32 -1.75,2.625 | smd 3.75 x 3.75: 33 0,0
SO-24DW = smd 0.584 x 2.032: 1 -6.35,-5.08; 2 -5.08,-5.08; 3 -3.81,-5.08; 4 -2.54,-5.08; 5 -1.27,-5.08; 6 0,-5.08; 7 1.27,-5.08; 8 2.54,-5.08; 9 3.81,-5.08; 10 5.08,-5.08; 11 6.35,-5.08; 12 7.62,-5.08; 13 7.62,5.08; 14 6.35,5.08; 15 5.08,5.08; 16 3.81,5.08; 17 2.54,5.08; 18 1.27,5.08; 19 0,5.08; 20 -1.27,5.08; 21 -2.54,5.08; 22 -3.81,5.08; 23 -5.08,5.08; 24 -6.35,5.08
1X04_LONGPADS = drill 1.118 pad 1.88 long: 1 0,0; 2 2.54,0; 3 5.08,0; 4 7.62,0
USB-B-MICRO-SMD_V03 = smd 1.4 x 0.4: D+1 2.7,0; D-1 2.7,0.65; GND1 2.7,-1.3; ID1 2.7,-0.65; VBUS1 2.7,1.3 | smd 1.5 x 1.8: SHIELD1 0,3.7; SHIELD2 0,-3.7 | smd 1.5 x 2.5: SHIELD3 0,0 | hole 0.85: 2.2,1.9; 2.2,-1.9
1X04-1.27MM = drill 0.508 pad 1: 1 0,0; 2 1.27,0; 3 2.54,0; 4 3.81,0
WINSTAR_WO1602I = smd 1.93 x 3.81 bottom: AB 23.329,-6.068; KB 23.365,3.926 | smd 1.93 x 3.81: AT 23.332,-6.069; KT 23.368,3.924 | drill 0.4: CAP1P -5.975,-10.33; CAPN -7.244,-10.328; RST 0.374,-10.33; SCL -0.894,-10.33; SDA -2.166,-10.33; VDD -4.704,-10.331; VOUT -8.516,-10.329; VSS -3.438,-10.331
LED-0603 = smd 1 x 1: A 0,-0.877; C 0,0.877
VIBE-MOTOR-10MM = drill 0.8 pad 1.676: + -5,-3.9; - -6.35,-2.54
CRYSTAL_3.2X2.5 = smd 1.3 x 1.1: 1 -1.1,-0.9; 2 1.2,-0.9; 3 1.2,1; 4 -1.1,1
SOT23 = smd 1 x 1.4: 1 -0.95,-1.1; 2 0.95,-1.1; 3 0,1.1
SOT23-3 = smd 0.8 x 0.9: 1 -0.95,-1; 2 0.95,-1; 3 0,1.1
SOT323 = smd 0.7 x 0.7: 1 -0.65,-0.925; 2 0.65,-0.925; 3 0,0.925
0402-RES = smd 0.7 x 0.9: 1 -0.65,0; 2 0.65,0
TACTILE-SWITCH-1101NE = smd 2.3 x 1.6: 1 -3.15,0; 2 3.15,0
JOYSTICK_MINI = smd 1.85 x 1.1: A -3.325,1.4; B 3.325,1.4; C -3.325,-1.4; CTR -3.325,0; D 3.325,-1.4; GND 3.325,0 | smd 1.9 x 2: NC 0,4.13; NC@0 0,-4.13 | hole 0.75: 0,1.9 | hole 1.05: 0,-1.9
NAV_SWITCH = smd 1.9 x 1.8: 1 -2.5,-3.8; 2 2.5,-3.8; T 0,-3.8 | smd 1.6 x 1.5: C 5.4,0.95; NC -5.4,0.95 | hole 1.1: -2.5,0; 2.5,0
PB6136 = drill 1: C1 5.08,3.81; C2 5.08,-1.27; LED+ 0,1.27; LED- 10.16,1.27; NC1 2.54,3.81; NC2 2.54,-1.27; NO1 7.62,3.81; NO2 7.62,-1.27
BUZZER-CCV = smd 3.2 x 2.5: + 4,0; - -4,0 | hole 0.8: -3.9,-2.25; 2.25,3.9
PAD-JUMPER-2-NC_BY_TRACE_YES_SILK = smd 0.635 x 1.27: 1 -0.508,0; 2 0.508,0
PAD.03X.05 = smd 1.27 x 1.27: P$1 0,0

### Placement (x,y rotation side)
C1  12.83,41.97 180 top
C2  12.07,37.14 180 top
C3  14.86,45.02 180 top
C4  14.86,43.75 180 top
C5  16.64,55.81 180 top
C6  22.99,66.1 270 top
C7  16.64,62.03 180 top
C8  16.64,56.95 0 top
C9  82.05,27.62 90 top
C10  87.13,27.62 90 top
C11  83.32,27.62 90 top
C12  85.86,27.62 90 top
C13  46.49,68.51 270 top
C14  84.59,27.62 90 top
C15  18.25,27.79 56 top
C16  20.3,26.41 56 top
C17  22.33,25 56 top
C18  47.38,39.68 0 top
C19  11.05,71.43 90 top
C20  101.48,55.56 270 top
C21  17.66,88.7 270 top
C22  46.74,11.87 90 top
C23  101.48,91.24 270 top
C24  83.7,55.56 270 top
C25  80.4,93.53 270 top
C26  80.4,57.82 270 top
C27  101.48,73.21 270 top
C28  101.48,37.52 270 top
C29  80.4,75.5 270 top
C30  80.65,39.81 270 top
C31  83.7,73.21 270 top
C32  48.14,9.08 90 top
C33  51.57,69.91 90 top
C34  50.42,69.91 90 top
C35  47.12,35.62 90 top
C36  52.2,35.62 90 top
C37  57.28,35.62 90 top
D1  7.75,52.64 0 top
D2  13.34,90.23 90 top
F1  6.99,49.84 180 top
FID1  114.18,29.01 0 top
FID2  114.69,91.75 0 top
FID3  65.92,28.51 0 top
FID4  62.87,92.01 0 top
IC1  13.34,39.68 90 top
IC2  24.26,60.76 0 top
IC3  38.23,73.46 180 top
IC4  39.5,48.06 180 top
JP1  43.06,91.5 180 top
JP2  1.15,47.56 0 top
JP3  73.79,88.7 270 top
JP4  76.33,70.92 270 top
JP5  76.33,53.14 270 top
JP6  76.33,35.36 270 top
JP7  68.71,84.89 90 top
JP8  68.71,67.11 90 top
JP9  68.71,49.33 90 top
JP10  66.17,31.55 90 top
JP11  73.79,70.92 270 top
JP12  73.79,53.14 270 top
JP13  73.79,35.36 270 top
JP14  78.87,35.36 270 top
JP15  66.17,67.11 90 top
JP16  66.17,49.33 90 top
JP17  63.89,31.55 90 top
JP18  68.46,31.55 90 top
LCD1  59.31,63.3 270 top
LED1  11.94,43.75 270 top
LOGO1  52.2,47.3 0 top
MOT1  10.29,82.35 270 top
Q1  17.4,59.49 0 top
Q2  21.21,51.87 180 top
Q3  31.37,83.37 0 top
Q4  16.64,91.5 90 top
Q5  63.25,43.11 180 top
R1  46.87,89.21 90 top
R2  45.34,89.21 90 top
R3  11.82,52.64 0 top
R4  11.82,53.91 180 top
R5  18.04,46.67 90 top
R6  6.99,48.57 0 top
R7  6.99,47.3 0 top
R8  29.09,83.12 90 top
R9  84.59,39.81 270 top
R10  87.13,39.81 270 top
R11  82.05,39.81 90 top
R12  85.86,39.81 90 top
R13  83.32,39.81 90 top
R14  46.49,70.8 270 top
R15  19.22,27.1 56 top
R16  21.26,25.74 56 top
R17  23.37,24.27 56 top
R18  47.38,40.95 180 top
R19  12.32,71.43 90 top
R20  16.13,88.7 90 top
R21  101.48,57.84 90 top
R22  101.48,93.53 90 top
R23  83.7,57.82 90 top
R24  101.48,75.5 90 top
R25  101.48,39.81 90 top
R26  83.7,75.5 90 top
R27  46.74,9.08 90 top
R28  50.68,63.56 90 top
R29  63.89,45.65 270 top
R30  11.82,45.02 0 top
R31  47.12,37.9 90 top
R32  52.2,37.9 90 top
R33  57.28,37.9 90 top
S1  4.96,74.99 180 top
S2  89.67,33.46 0 top
S3  31.25,18.6 144.5 top
S4  5.47,69.15 270 top
S5  103,50.6 0 top
S6  103,86.16 0 top
S7  85.22,50.6 0 top
S8  103,68.38 0 top
S9  103,32.82 0 top
S10  85.22,68.38 0 top
S11  50.93,6.15 0 top
S12  49.66,33.59 90 top
S13  54.74,33.59 90 top
S14  59.82,33.59 90 top
SG1  26.8,88.7 90 top
SJ1  46.11,92.01 270 top
TP1  23.12,40.57 0 top
TP2  3.18,40.19 90 top
TP3  31.37,59.75 0 top
TP4  31.37,57.34 0 top
TP5  77.35,64.07 0 top
TP6  1.66,71.43 0 top
TP7  11.18,32.06 0 top
U$1  [BQ_LOGO]  31.12,25.97 0 top
U$2  [PIGHIXXX_LOGO]  17.66,82.1 0 top

### Tracks (layer width: path | path; a pad name or v marks a point on that pad's centre or on a via)
3.3V  (via drill 0.3, 0.41, 0.6)  (5 unrouted)
  Top 0.254: IC2.6 20.97,60.01 20.71,59.75 20.71,56.19 | 20.71,56.19 20.71,53.42 Q2.2 14.69,52.97 14.36,52.64 v14.36,49.59 | v14.36,46.29 14.36,45.16 C3.2 | IC2.29 24.01,64.83 24.9,65.72 | C5.1 20.32,55.81 20.71,56.19
  Top 0.406: MOT1.+ 12.17,87.35 D2.C | v18.93,72.96 13.2,72.96 R19.2 | v20.45,72.96 24.26,72.96 | IC4.24 45.85,38.55 | IC4.21 42.04,38.68 42.17,38.55 | 29.85,65.08 v29.6,64.83 | IC3.24 44.71,68.38 | 46.47,69.15 C13.1 | C33.1 51.57,68.26 51.31,68 LCD1.VDD 50.68,66.31 R28.2 | 22.92,23.73 R17.1 24.13,22.92 25.4,24.19 28.07,24.19 41.04,11.22 C22.1 R27.2
  Top 0.61: R25.2 R10.1 R12.2 R9.1 R13.2 R11.2 C30.1 80.63,40.44 77.35,40.44 73.79,36.89 JP13.1 | JP12.1 73.79,54.41 77.86,58.48 80.39,58.48 C26.1 R23.2 83.72,58.49 R21.2 | JP11.1 73.79,72.7 77.24,76.15 C29.1 R26.2 R24.2 | R22.2 C25.1 77.24,94.18 73.79,90.74 JP3.1 | R32.2 R31.2 46.73,38.55 | R32.2 R33.2 60.82,38.55 61.85,37.52 63.12,37.52 63.63,37.02 | R32.2 52.2,39.68 51.95,39.94 53.21,39.94 LCD1.AT | R30.2 C3.2 C4.2 14.21,43.13 15.37,41.97 15.37,40.95 15.05,40.63 | IC1.5 15.05,40.63 | 24.26,66.35 24.26,72.96 24.26,90.16 | 24.26,66.35 24.9,65.72 25.02,65.59 28.83,65.59 v29.6,64.83 | v28.58,53.65 28.58,46.03 16.64,34.09 16.64,26.09 18.55,24.82 | 24.26,90.16 SG1.+ 28.01,91.5 JP1.4 35.44,93.53 36.2,94.29 46.11,94.29 | D2.C 13.34,86.93 14.1,86.16 18.93,86.16 19.44,86.67 19.44,88.96 19.04,89.35 | C21.1 19.04,89.35 | 24.26,90.16 23.45,89.35 19.04,89.35 | 46.11,94.29 63.12,94.29 JP7.4 69.85,88.7 69.98,88.58 69.98,73.97 | SJ1.1 46.11,94.29 | IC3.24 44.58,65.59 44.07,65.08 29.85,65.08 | R14.2 C13.1 47.36,69.16 47.76,68.77 47.76,68.26 48.01,68 LCD1.VDD | 44.71,68.38 45.47,69.15 46.47,69.15 | R18.2 C18.1 46.73,38.55 | 46.73,38.55 45.85,38.55 42.17,38.55 25.14,38.55 TP1.P$1 15.11,40.57 15.05,40.63 | C6.1 23.87,66.75 24.26,66.35 | 69.98,73.97 69.98,56.7 | 69.98,56.7 69.98,37.4 69.47,36.89 63.76,36.89 63.63,37.02 | 63.63,37.02 63.63,35.62 JP17.4 | JP16.4 66.17,54.92 67.19,55.94 69.22,55.94 69.98,56.7 | JP15.4 66.17,72.19 67.19,73.21 69.22,73.21 69.98,73.97 | 18.55,24.82 18.55,26.25 R15.1 | 20.45,24.57 19.56,24.19 18.55,24.82 | 20.45,24.57 20.45,23.55 21.59,22.79 22.48,23.05 22.92,23.73 | R16.1 20.45,24.57
  Bottom 0.254: v14.36,49.59 v14.36,46.29
  Bottom 0.406: v18.93,72.96 v20.45,72.96
  Bottom 0.61: v29.6,64.83 29.6,54.67 v28.58,53.65
BACK  (1 unrouted)
  Top 0.406: Q5.3 63.24,42.17 LCD1.KT
BUZZ  (via drill 0.3)
  Top 0.254: IC2.20 27.43,60.51 27.44,60.51 27.56,60.51 27.69,60.38 27.69,59.88 27.82,59.75 v28.71,59.75 | v28.96,81.34 28.96,82.34 R8.1
  Bottom 0.254: v28.71,59.75 28.96,60 28.96,63.94 28.58,64.32 28.58,80.96 v28.96,81.34
CI01
  Top 0.406: R22.1 C23.1 | C23.1 107.69,91.89 108.08,91.5 S6.C1 S6.C2 | JP3.2 75.06,87.43 75.32,87.69 75.32,90.23 76.84,91.75 arc-90 76.98,91.89 C23.1
CI02
  Top 0.406: S6.LED+ 101.73,86.16 JP3.3
CI03  (via drill 0.41)
  Top 0.406: R24.1 C27.1 | C27.1 107.69,73.86 108.08,73.46 S8.C1 S8.C2 | JP11.2 74.81,69.65 75.06,69.91 75.06,72.19 76.84,73.97 77.09,73.97 v79.13,73.97 | v99.95,73.97 101.37,73.97 C27.1
  Bottom 0.406: v79.13,73.97 v99.95,73.97
CI04
  Top 0.406: JP11.3 74.55,68.38 75.06,67.88 75.06,66.35 75.82,65.59 102.49,65.59 103,66.1 S8.LED+
CI05
  Top 0.406: R26.1 C31.1 | C31.1 89.91,73.86 90.3,73.46 S10.C1 S10.C2 | JP4.1 81.67,70.92 82.17,71.43 82.17,73.46 82.68,73.97 83.59,73.97 C31.1
CI06
  Top 0.406: S10.LED+ JP4.2
CI07  (via drill 0.41)
  Top 0.406: C20.1 107.56,56.21 108.08,55.68 S5.C1 S5.C2 | C20.1 R21.1 | JP12.2 74.3,51.87 75.06,52.64 75.06,54.16 77.09,56.19 v79.13,56.19 | v98.94,56.19 101.46,56.19 C20.1
  Bottom 0.406: v79.13,56.19 v98.94,56.19
CI08
  Top 0.406: JP12.3 74.55,50.6 75.06,50.1 75.06,48.32 75.57,47.81 102.49,47.81 103,48.32 S5.LED+
CI09
  Top 0.406: R23.1 C24.1 | C24.1 89.78,56.21 90.3,55.68 S7.C1 S7.C2 | JP5.1 81.41,53.14 81.92,53.65 81.92,55.94 82.17,56.19 83.68,56.19 C24.1
CI10
  Top 0.406: JP5.2 S7.LED+
CI11  (via drill 0.41)
  Top 0.254: v99.95,37.9 100.21,38.16 | 101.46,39.17 R25.1
  Top 0.406: S9.C2 S9.C1 108.08,37.9 107.81,38.17 C28.1 R25.1 | JP13.2 75.06,34.09 75.32,34.35 75.32,36.13 77.09,37.9 v80.14,37.9 | 100.21,38.16 100.21,38.92 100.46,39.17 101.46,39.17
  Bottom 0.406: v80.14,37.9 v99.95,37.9
CI12  (via drill 0.41)
  Top 0.406: JP13.3 74.68,32.82 74.93,32.57 74.93,28.63 76.2,27.36 v80.01,27.36
  Bottom 0.406: v80.01,27.36 102.11,27.36 103,28.25 S9.LED+
CI21  (via drill 0.41)
  Top 0.406: C9.2 82.05,33.21 83.7,34.86 | 83.7,34.86 S2.A | R9.2 v84.59,36.89 84.59,35.75 83.7,34.86 | JP6.1 77.35,35.36 77.73,35.75 77.73,36.51 78.11,36.89 v80.14,36.89
  Bottom 0.406: v80.14,36.89 v84.59,36.89
CI22  (via drill 0.41)
  Top 0.406: C10.2 87.13,29.65 87.51,30.03 88.02,30.03 88.27,30.28 88.27,30.54 88.52,30.79 v88.52,31.17 88.52,31.81 89.29,32.57 90.05,32.57 90.56,32.06 S2.D 95.13,32.06 95.38,32.32 95.38,38.41 94.63,39.16 R10.2 | JP6.2 77.68,34.09 77.93,33.84 77.93,30.79 78.31,30.41 v80.01,30.41
  Bottom 0.406: v80.01,30.41 88.14,30.41 88.52,30.79 v88.52,31.17
CI23  (via drill 0.41)
  Top 0.406: C11.2 v83.32,29.4 83.32,32.7 83.95,33.33 84.46,33.33 | S2.CTR 86.21,33.33 84.46,33.33 | R13.1 83.32,36 v83.19,35.87 | v83.95,33.84 84.46,33.33 | JP6.3 76.99,32.82 77.27,32.55 77.27,30.01 77.88,29.4 v80.01,29.4
  Bottom 0.406: v83.19,35.87 83.19,34.6 v83.95,33.84 | v80.01,29.4 v83.32,29.4
CI24  (via drill 0.41)
  Top 0.406: C12.2 v85.86,28.76 85.86,29.9 86.75,30.79 87.51,30.79 87.76,31.05 87.76,33.33 88.52,34.09 | S2.B 91.32,34.86 90.56,34.09 88.52,34.09 | R12.1 85.86,37.14 86.36,36.63 87.25,36.63 88.02,35.87 88.02,34.6 88.52,34.09 | JP6.4 76.33,29.01 76.97,28.38 v80.01,28.38
  Bottom 0.406: v80.01,28.38 85.48,28.38 v85.86,28.76
CI25  (via drill 0.41)
  Top 0.406: C14.2 84.59,31.68 84.97,32.06 | 84.97,32.06 S2.C | R11.1 81.92,39.03 v81.92,34.35 80.9,35.36 JP14.1 | v84.46,32.32 84.71,32.06 84.97,32.06
  Bottom 0.406: v81.92,34.35 83.95,32.32 v84.46,32.32
CTBL  (via drill 0.3)
  Top 0.254: IC2.22 32.25,61.51 32.26,61.53 45.09,61.53 v45.34,61.27 | v63.89,47.81 R29.1
  Bottom 0.254: v45.34,61.27 45.6,61.53 53.34,61.53 53.6,61.27 53.6,51.24 54.87,49.97 63.38,49.97 63.89,49.46 v63.89,47.81
D+
  Top 0.406: R7.1 6.09,47.56 JP2.D+1
D-
  Top 0.406: R6.1 5.97,48.21 JP2.D-1
GND  (via drill 0.3)  (4 unrouted)
  Top 0.254: v24.72,60.28 24.72,60.31 IC2.33
  other vias: 94.37,33.46 91.57,33.46 85.48,36.13 11.15,39.68 10.27,39.68 23.78,61.25 24.72,61.25 23.78,60.28 17.68,87.21 17.56,65.95 20.73,65.82 14.96,39.68 15.85,39.68 38.26,66.2 39.53,66.2 40.67,66.2 38.26,70.9 39.53,70.9 40.67,70.9 43.34,40.42 44.61,40.42 12.86,47.94 68.61,90.84 19.54,25.2 21.44,23.93 17.5,26.6 27.16,27.62 27.16,26.14
  pour Bottom: 71.89,25.2 125.86,25.2 125.86,41.71 71.89,41.71
  pour Top: 71.89,41.71 71.89,25.2 125.86,25.2 125.86,41.71
  pour Top: 71.89,59.49 71.89,42.98 125.86,42.98 125.86,59.49
  pour Bottom: 71.89,42.98 125.86,42.98 125.86,59.49 71.89,59.49
  pour Top: 71.89,77.91 71.89,62.03 123.96,62.03 123.96,77.91
  pour Bottom: 71.89,62.03 123.96,62.03 123.96,77.27 103.64,77.91 71.89,77.91
  pour Top: 71.89,95.69 123.96,95.69 123.96,79.81 71.89,79.81
  pour Bottom: 71.89,79.81 123.96,79.81 123.96,95.69 71.89,95.69
  pour Top: -2.41,96.32 -2.41,34.09 34.42,-2.74 71.25,-2.74 71.25,96.32
  pour Bottom: 56.01,96.32 -2.41,96.32 -2.41,34.09 35.06,-3.37 71.25,-3.37 71.25,96.32
INTA  (via drill 0.3)
  Top 0.254: IC2.24 30.33,62.51 30.36,62.54 46.11,62.54 46.36,62.8 v46.36,66.86 | R14.1 v46.49,72.32 46.49,74.48 44.58,76.39 IC3.1
  Bottom 0.254: v46.36,66.86 46.36,72.19 v46.49,72.32
INTB
  Top 0.254: IC2.23 30.59,62.01 | 30.59,62.01 30.61,62.03 | 30.59,62.01 46,62.01 46.23,61.78 46.23,54.8 45.85,54.41 IC4.1 45.98,53.02 45.98,51.75 47.25,50.48 47.25,42.73 48.03,41.95 R18.1
MI01
  Top 0.406: IC3.4 40.77,80.07 41.28,80.58 66.04,80.58 66.81,81.34 66.81,86.8 67.31,87.31 68.58,87.31 JP7.3
MI02  (via drill 0.41)
  Top 0.406: IC3.5 39.5,80.96 40.14,81.59 64.9,81.59 65.54,82.23 65.54,85.66 v65.79,85.91
  Bottom 0.406: v65.79,85.91 66.04,86.16 JP7.2
MI03  (via drill 0.41)
  Top 0.406: IC3.6 38.23,80.96 39.88,82.61 v59.82,82.61
  Bottom 0.406: JP15.3 65.41,69.65 60.33,74.73 60.33,82.1 v59.82,82.61
MI04  (via drill 0.41)
  Top 0.406: IC3.7 36.96,80.83 39.76,83.62 v58.3,83.62
  Bottom 0.406: JP15.2 65.28,68.38 62.62,71.05 arc6 58.81,74.48 58.81,83.12 v58.3,83.62
MI05  (via drill 0.41)
  Top 0.406: IC3.8 35.69,80.83 39.5,84.64 v62.87,84.64
  Bottom 0.406: JP8.4 68.71,73.21 67.57,74.35 65.79,74.35 63.63,76.51 63.63,83.88 v62.87,84.64
MI06  (via drill 0.41)
  Top 0.406: IC3.9 34.42,80.7 39.37,85.66 v60.08,85.66
  Bottom 0.406: JP8.3 68.08,69.65 67.7,70.04 67.7,71.94 66.43,73.21 64.14,73.21 61.35,76 61.35,85.15 60.84,85.66 v60.08,85.66
MI07  (via drill 0.41)
  Top 0.406: IC3.10 33.15,76.89 33.53,76.51 v42.68,76.51
  Bottom 0.406: v42.68,76.51 54.23,76.51 54.87,75.88 54.87,52.51 55.5,51.87 JP16.3
MI08  (via drill 0.41)
  Top 0.406: IC3.11 31.88,76.89 33.02,75.75 43.57,75.75 v43.69,75.62
  Bottom 0.406: v43.69,75.62 53.73,75.62 54.23,75.12 54.23,51.37 55,50.6 JP16.2
MI09  (via drill 0.41)
  Top 0.406: v58.55,58.22 58.17,58.22 57.03,59.37 57.03,73.85 56.01,74.86 50.42,74.86 v50.3,74.73 | v42.93,74.73 32.39,74.73 30.61,72.96 IC3.13
  Bottom 0.406: JP9.4 68.71,57.46 68.08,58.1 58.68,58.1 v58.55,58.22 | v50.3,74.73 v42.93,74.73
MI10  (via drill 0.41)
  Top 0.406: IC3.14 31.88,72.83 32.9,73.85 v43.95,73.85 | v51.44,73.97 55.5,73.97 56.01,73.46 56.01,59.11 v57.79,57.34
  Bottom 0.406: JP9.3 67.95,51.87 67.44,52.38 67.44,56.83 66.93,57.34 v57.79,57.34 | v43.95,73.85 51.31,73.85 v51.44,73.97
MI11  (via drill 0.41)
  Top 0.406: v60.2,40.57 60.2,51.75 57.28,54.67 v48.39,54.67 | IC3.15 33.15,70.42 v33.53,70.8 | v34.17,55.05 44.71,55.05 v44.84,54.92
  Bottom 0.406: v60.2,40.57 60.2,37.52 62.62,35.11 62.62,34.6 63.12,34.09 JP17.3 | v33.53,70.8 33.53,55.68 v34.17,55.05 | v44.84,54.92 48.14,54.92 v48.39,54.67
MI12  (via drill 0.41)
  Top 0.406: v59.31,39.94 59.31,51.37 57.03,53.65 v52.58,53.65 | IC3.16 34.42,70.42 v34.68,70.67 | v35.31,56.19 v45.34,56.19 | v48.52,56.07 51.57,56.07 v51.95,55.68
  Bottom 0.406: v59.31,39.94 59.31,36.89 61.85,34.35 61.85,33.59 62.62,32.82 JP17.2 | v34.68,70.67 34.68,56.83 v35.31,56.19 | v45.34,56.19 48.39,56.19 v48.52,56.07 | v51.95,55.68 51.95,54.29 v52.58,53.65
MI13  (via drill 0.41)
  Top 0.406: IC3.17 35.69,67.11 35.31,66.73 31.37,66.73 v31.12,66.48 | S11.C2 S11.C1 56.01,9.08 55.63,8.69 50.17,8.69 49.9,8.43 C32.1 R27.1 45.36,8.43 v44.07,9.71
  Bottom 0.406: v31.12,66.48 31.12,22.66 v44.07,9.71
MI14  (via drill 0.41)
  Top 0.406: IC3.18 36.96,66.48 36.58,66.1 32.39,66.1 v32.26,65.97
  Bottom 0.406: v32.26,65.97 32.26,23.3 48.14,7.42 S11.LED+
MI18  (via drill 0.41)
  Top 0.406: IC4.4 42.04,50.99 42.3,50.73 42.8,50.73 42.93,50.6 42.93,47.18 42.3,46.54 35.18,46.54 v35.06,46.41 | C15.2 R15.2 20.33,28.38 v35.06,28.38 35.06,23.05 35.95,22.16 35.95,20.89 35.49,20.43 S3.1
  Bottom 0.406: v35.06,46.41 v35.06,28.38
MI19  (via drill 0.41)
  Top 0.406: IC4.5 40.77,50.48 41.15,50.1 41.79,50.1 42.17,49.72 42.17,47.3 42.04,47.18 34.42,47.18 v34.17,46.92 | C16.2 R16.2 22.2,26.86 v34.17,26.86 34.17,22.66 33.45,21.95 S3.T
  Bottom 0.406: v34.17,46.92 v34.17,26.86
MI20  (via drill 0.41)
  Top 0.406: IC4.6 39.5,52 40.01,51.49 40.01,49.84 40.52,49.33 41.28,49.33 41.53,49.08 41.53,48.06 41.28,47.81 v33.28,47.81 | C17.2 R17.2 24.25,25.33 v33.15,25.33 33.15,24.88 S3.2
  Bottom 0.406: v33.28,47.81 33.15,47.68 v33.15,25.33
MI21  (via drill 0.3)
  Top 0.406: IC4.7 38.23,51.62 38.49,51.24 v38.99,51.24
  Bottom 0.406: v38.99,51.24 39.5,51.11 39.5,43.11 39.88,42.73 65.79,42.73 66.3,42.22 66.3,35.49 arc-90 JP10.4
MI22  (via drill 0.3)
  Top 0.406: IC4.8 36.96,50.99 v37.34,50.6
  Bottom 0.406: v37.34,50.6 37.85,50.6 38.49,49.97 38.49,42.35 39.12,41.71 65.03,41.71 65.66,41.08 65.66,37.02 65.16,36.25 65.16,34.98 66.04,34.09 JP10.3
MI23  (via drill 0.3)
  Top 0.406: IC4.9 35.69,50.48 36.2,49.97 v36.58,49.97
  Bottom 0.406: v36.58,49.97 36.96,49.97 37.34,49.59 37.34,28.25 37.85,27.74 64.77,27.74 65.16,28.13 65.16,32.44 65.79,32.82 JP10.2
MI24  (via drill 0.3)
  Top 0.406: IC4.10 34.42,49.97 35.06,49.33 v35.56,49.33
  Bottom 0.406: JP10.1 66.17,27.62 65.66,27.11 37.47,27.11 36.71,27.87 36.71,48.83 36.2,49.33 v35.56,49.33
MI25  (via drill 0.3)
  Top 0.406: IC4.11 33.15,49.84 34.42,48.57 v40.64,48.57
  Bottom 0.406: v40.64,48.57 40.64,43.75 40.9,43.49 67.95,43.49 68.71,42.73 JP18.4
MI26  (via drill 0.41)
  Top 0.406: S12.2 49.4,37.25 R31.1 C35.2 45.99,36.27 v45.47,35.75 | IC4.13 31.88,40.32 32.77,39.43 v38.1,39.43
  Bottom 0.406: v38.1,39.43 38.1,37.52 39.88,35.75 v45.47,35.75
MI27  (via drill 0.41)
  Top 0.406: S13.2 54.48,37.25 R32.1 C36.2 51.42,36.27 v51.19,36.51 | IC4.14 33.15,40.7 33.66,40.19 38.99,40.19 v39.25,39.94
  Bottom 0.406: v39.25,39.94 39.25,37.65 40.26,36.63 51.19,36.63 v51.19,36.51
MI28  (via drill 0.41)
  Top 0.406: C37.2 R33.1 | S14.2 59.56,37.25 R33.1 | IC4.15 34.42,41.21 34.68,40.95 40.01,40.95 v40.26,40.7 | v56.39,37.27 57.27,37.27 R33.1
  Bottom 0.406: v40.26,40.7 40.26,37.9 40.77,37.4 56.27,37.4 v56.39,37.27
MI32  (via drill 0.41)
  Top 0.406: S4.C2 S4.C1 10.55,64.07 11.05,64.57 C19.1 R19.1 | IC4.19 39.5,44.38 39.12,44.89 33.15,44.89 v29.98,49.21
  Bottom 0.406: v29.98,49.21 28.96,49.21 26.93,51.24 14.61,51.24 13.59,52.26 13.59,63.43 12.96,64.07 S4.C1
MI33  (via drill 0.41)
  Top 0.406: IC4.20 40.64,44.89 40.39,45.52 33.66,45.52 v30.1,50.73
  Bottom 0.406: v30.1,50.73 29.09,50.73 27.44,52.38 15.63,52.38 14.74,53.27 14.74,68.26 13.85,69.15 S4.LED+
N$1
  Top 0.406: MOT1.- 11.05,88.7 11.56,89.21 11.56,91.24 12.07,91.75 13.16,91.75 D2.A 13.77,91.5 Q4.3
N$2
  Top 0.61: R20.2 16.13,89.97 16.64,90.48 17.58,90.48 Q4.1
N$6
  Top 0.406: R29.2 63.9,44.99 Q5.1
N$8
  Top 0.406: R30.1 11.07,44.92 LED1.A
N$10
  Top 0.406: C33.2 51.57,71.43 51.19,71.81 48.99,71.81 LCD1.VOUT
N$11
  Top 0.406: R28.1 49.01,62.91 LCD1.RST
N$12
  Top 0.406: C34.2 LCD1.CAPN
N$13
  Top 0.406: C34.1 50.4,69.28 LCD1.CAP1P
N$20
  Top 0.61: F1.1 7.84,52.04 7.24,52.64 D1.A
N$21
  Top 0.406: F1.2 5.15,48.86 JP2.VBUS1
N$28
  Top 0.406: Q3.3 31.37,85.4 30.99,85.78 27.31,85.78 27.06,85.4 27.06,84.96 SG1.-
N$30
  Top 0.406: R8.2 30.22,83.77 30.36,83.62 30.36,82.44 Q3.1
N$33
  Top 0.254: R7.2 18.02,47.3 R5.2 24.02,47.32 25.02,48.32 25.02,58.13 IC2.14
N$34
  Top 0.254: IC2.13 24.51,49.08 24.01,48.57 R6.2
N$35  (via drill 0.3)
  Top 0.254: R5.1 20.94,46.02 v21.21,46.29 | v21.21,49.33 Q2.3
  Bottom 0.254: v21.21,46.29 v21.21,49.33
N$36  (via drill 0.3)
  Top 0.254: IC2.15 25.51,55.96 v25.79,55.68 | v22.23,54.41 22.23,53.04 Q2.1
  Bottom 0.254: v25.79,55.68 23.5,55.68 v22.23,54.41
N$37
  Top 0.61: R1.2 45.85,89.86 | 45.85,89.86 R2.2 | SJ1.2 46.11,90.12 45.85,89.86
P0.3/ISP_COMMAND_USB_HIGH  (via drill 0.3)
  Top 0.254: IC2.9 22.51,56.73 v22.23,56.45 | R3.2 R4.1 v19.05,53.91
  Bottom 0.254: v22.23,56.45 20.32,56.45 20.07,56.19 20.07,54.29 19.69,53.91 v19.05,53.91
PROGR
  Top 0.254: IC2.3 20.21,61.51 19.69,62.03 19.69,74.48 19.18,74.99 S1.1
SCL  (via drill 0.3, 0.41)
  Top 0.254: IC2.10 23.01,56.68 v23.25,56.45 | v27.31,56.45 29.09,58.22 31.25,58.22 | 31.25,58.22 v41.91,58.22 | v41.91,66.23 41.91,68.26 IC3.22 | v47.5,66.23 47.63,66.1 47.63,64.83 48.26,64.2 LCD1.SCL | TP4.P$1 31.37,58.1 31.25,58.22 | IC4.22 v43.31,44.64
  Top 0.406: R2.1 41.17,88.56 40.52,89.21 JP1.2 | v42.04,71.43 IC3.22
  Bottom 0.254: v23.25,56.45 v27.31,56.45 | v47.5,66.23 45.34,66.23 44.71,66.86 42.55,66.86 v41.91,66.23 v41.91,58.22 41.91,46.03 v43.31,44.64
  Bottom 0.406: JP1.2 40.52,72.96 v42.04,71.43
SDA  (via drill 0.3, 0.41)
  Top 0.254: IC2.11 23.51,57.45 v23.75,57.21 | v26.55,57.21 26.93,57.21 28.58,58.86 31.37,58.86 | 31.37,58.86 43.06,58.86 43.31,59.11 v43.31,60.26 | v43.31,66.1 IC3.23 | TP3.P$1 31.37,58.86 | IC4.23 v44.58,44.89
  Top 0.406: R1.1 46.87,87.94 46.61,87.69 38.49,87.69 37.98,88.2 JP1.3 | v38.74,72.96 42.3,72.96 43.31,71.94 IC3.23
  Bottom 0.254: v23.75,57.21 v26.55,57.21 | LCD1.SDA 43.94,65.47 arc-90 v43.31,66.1 v43.31,60.26 43.31,46.16 v44.58,44.89
  Bottom 0.406: JP1.3 37.98,73.72 v38.74,72.96
VCC  (via drill 0.6)
  Top 0.406: 12.18,40.69 IC1.1
  Top 0.61: D1.C R3.1 11.17,49.95 v11.05,49.84 | 12.18,40.69 C1.2 v11.05,41.97 | IC1.1 9.72,40.63 9.53,40.44 9.28,40.19 | IC1.3 11.56,38.73 | 11.56,38.73 9.72,38.73 9.28,39.17 9.28,40.19 | C2.2 11.42,38.59 11.56,38.73 | TP2.P$1 9.28,40.19
  Bottom 0.61: v11.05,49.84 v11.05,41.97
VIB  (via drill 0.3)
  Top 0.254: IC2.21 27.82,61.01 v28.33,60.51 | v16.13,87.18 R20.1
  Bottom 0.254: v28.33,60.51 28.33,63.81 27.82,64.32 16.64,64.32 16.13,64.83 v16.13,87.18
XTALIN
  Top 0.254: C7.1 18.17,62.03 18.67,61.53 18.67,60.56 Q1.3 18.62,60.51 19.69,60.51 20.19,61.01 IC2.4
XTALOUT
  Top 0.254: IC2.5 20.46,60.51 20.2,60.26 20.2,59.75 19.94,59.49 16.64,59.49 16.39,59.24 16.39,58.68 Q1.1 15.99,58.28 C8.1

### Text on the board
tPlace: I2C | SDA | SCL | BTN7 | PROGR | BTN6 | BTN5 | SDA | SHIFT | SCL | BTN4 | BTN3 | PWR | 5V | 3.3V | JOYSTICK | BTN2 | GND | DOWN | UP | OK/ / ESC | BTN1
bNames: MUNDO READER S.L. 2015 | ALVARO FERRAN / PIGHIXXX